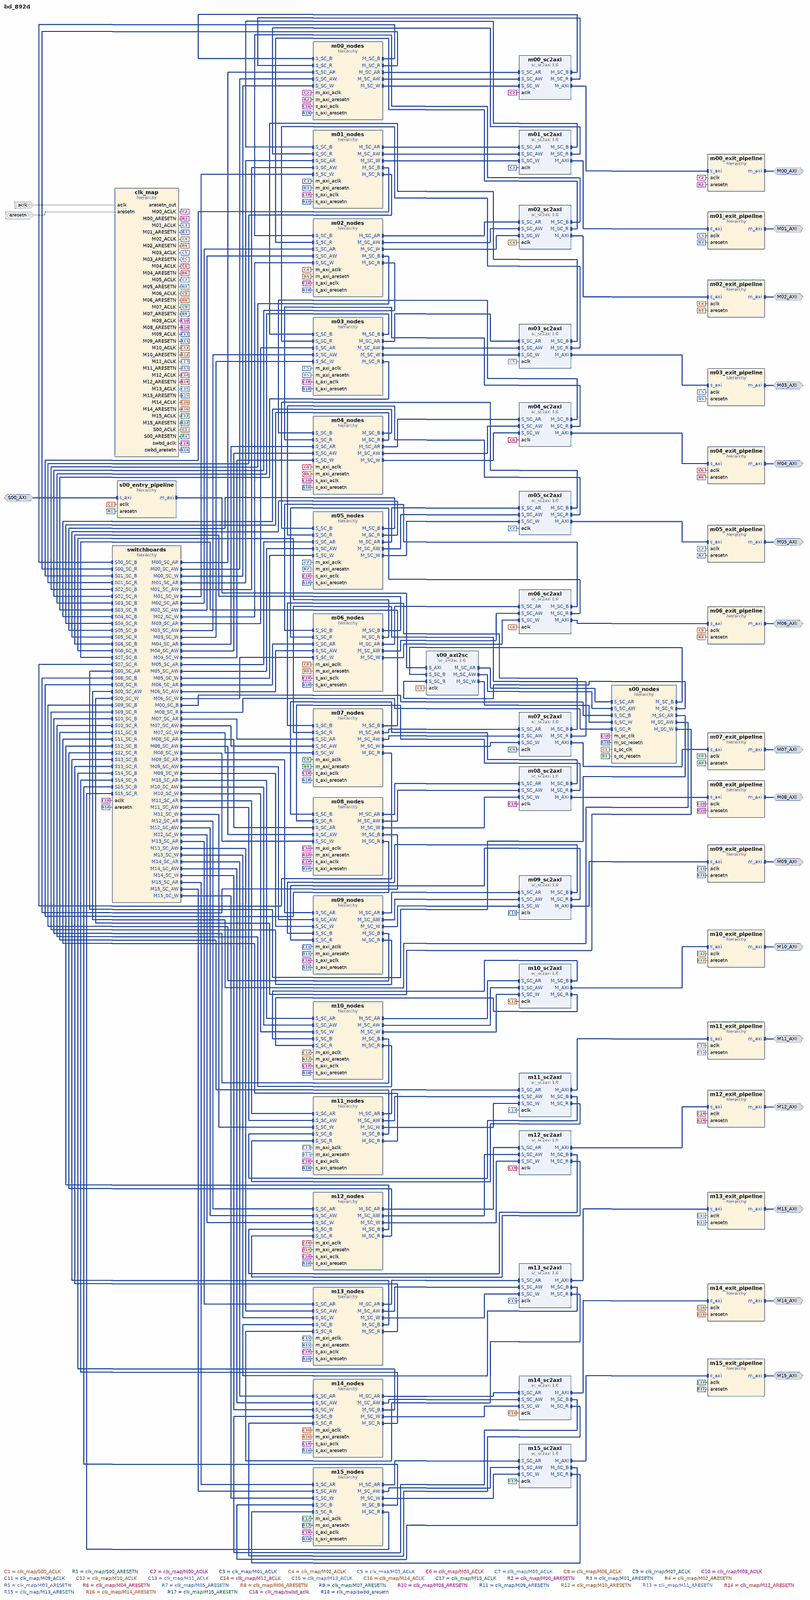
[diagram p0: block diagram of the top level, whole]
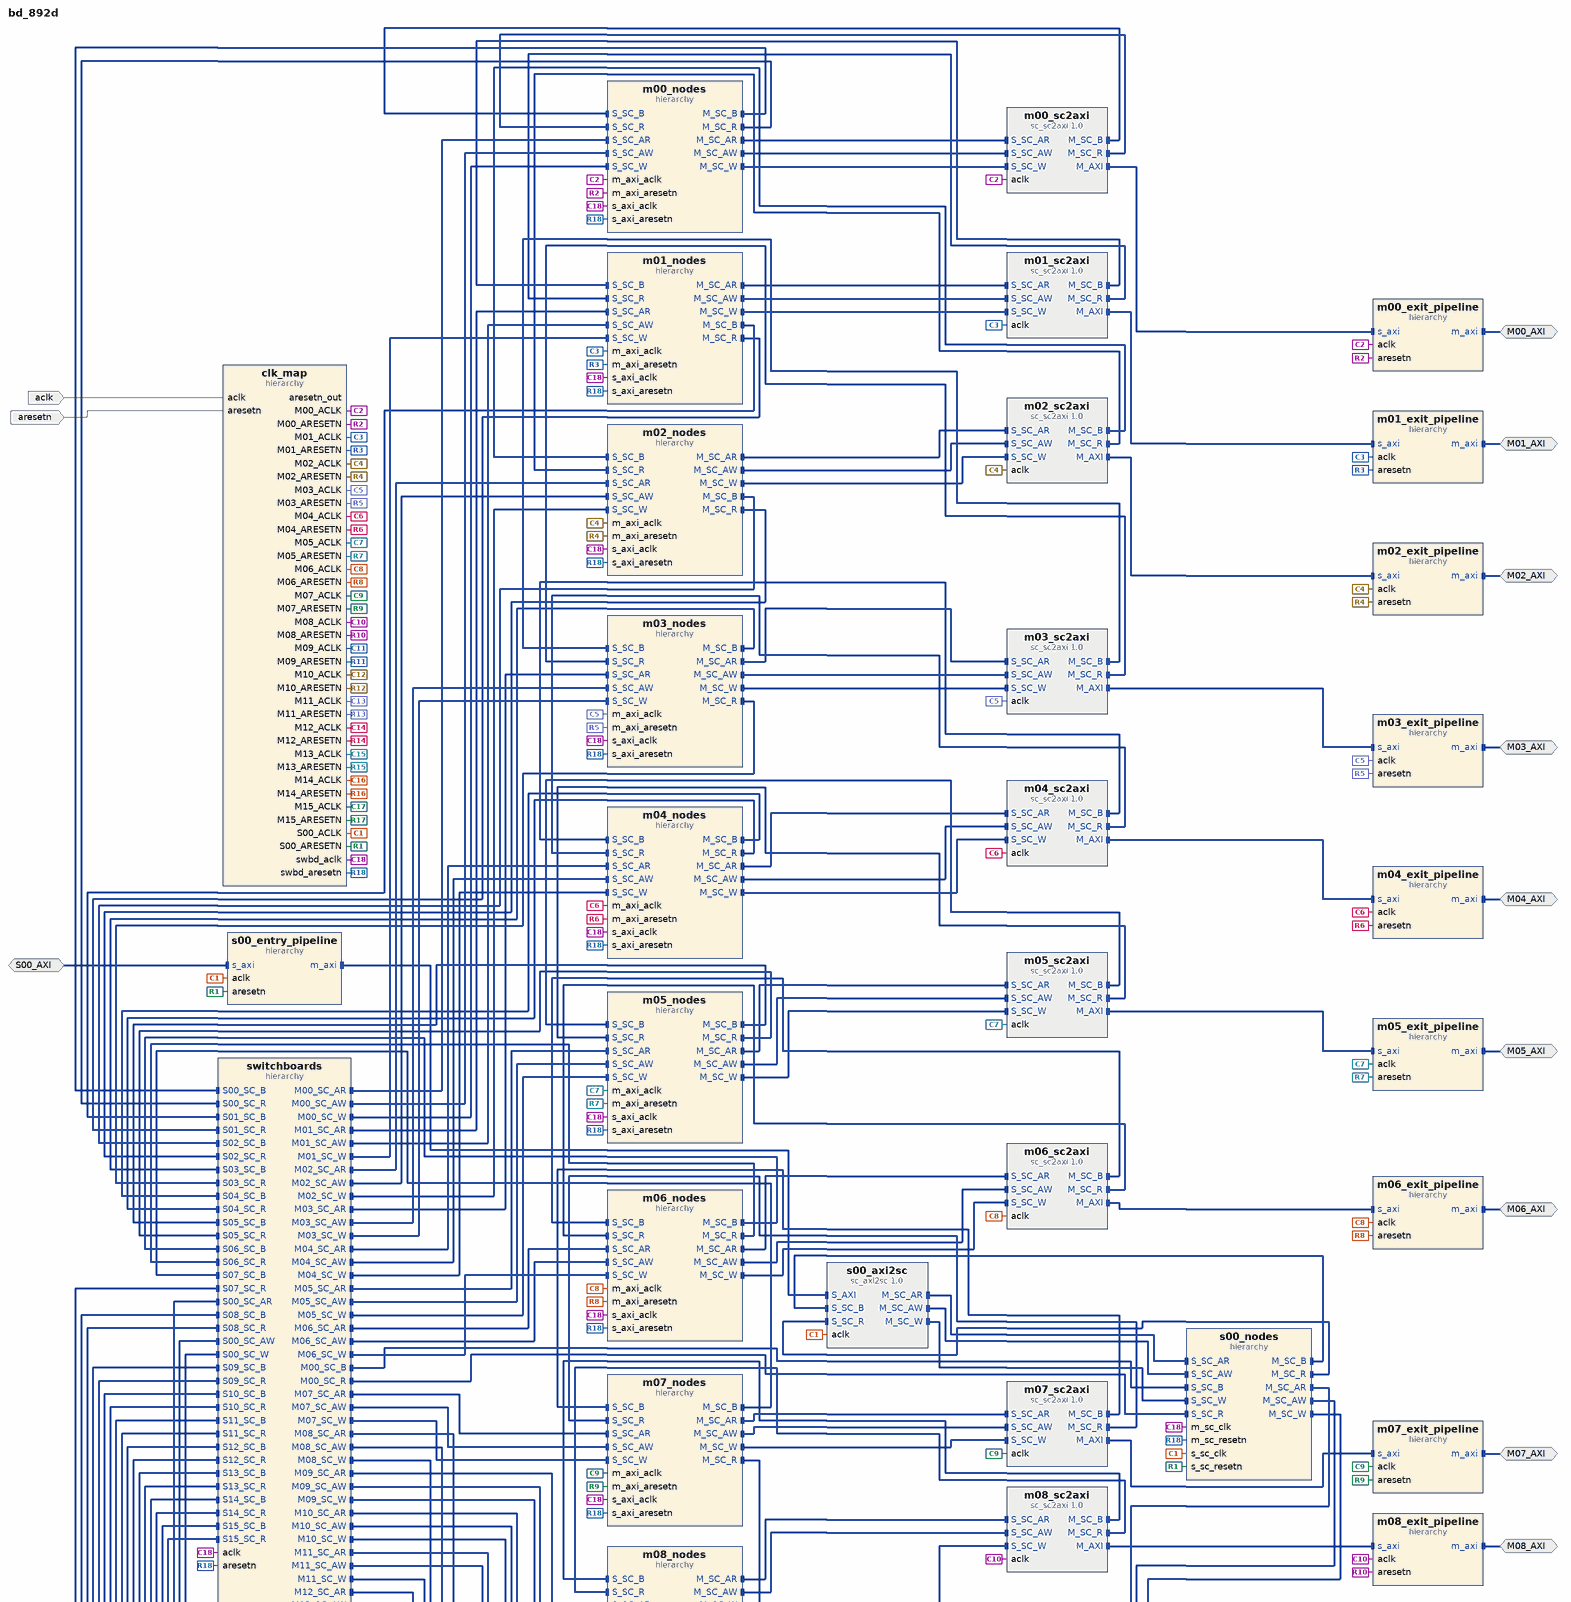
[diagram p1: block diagram of the top level, upper part]
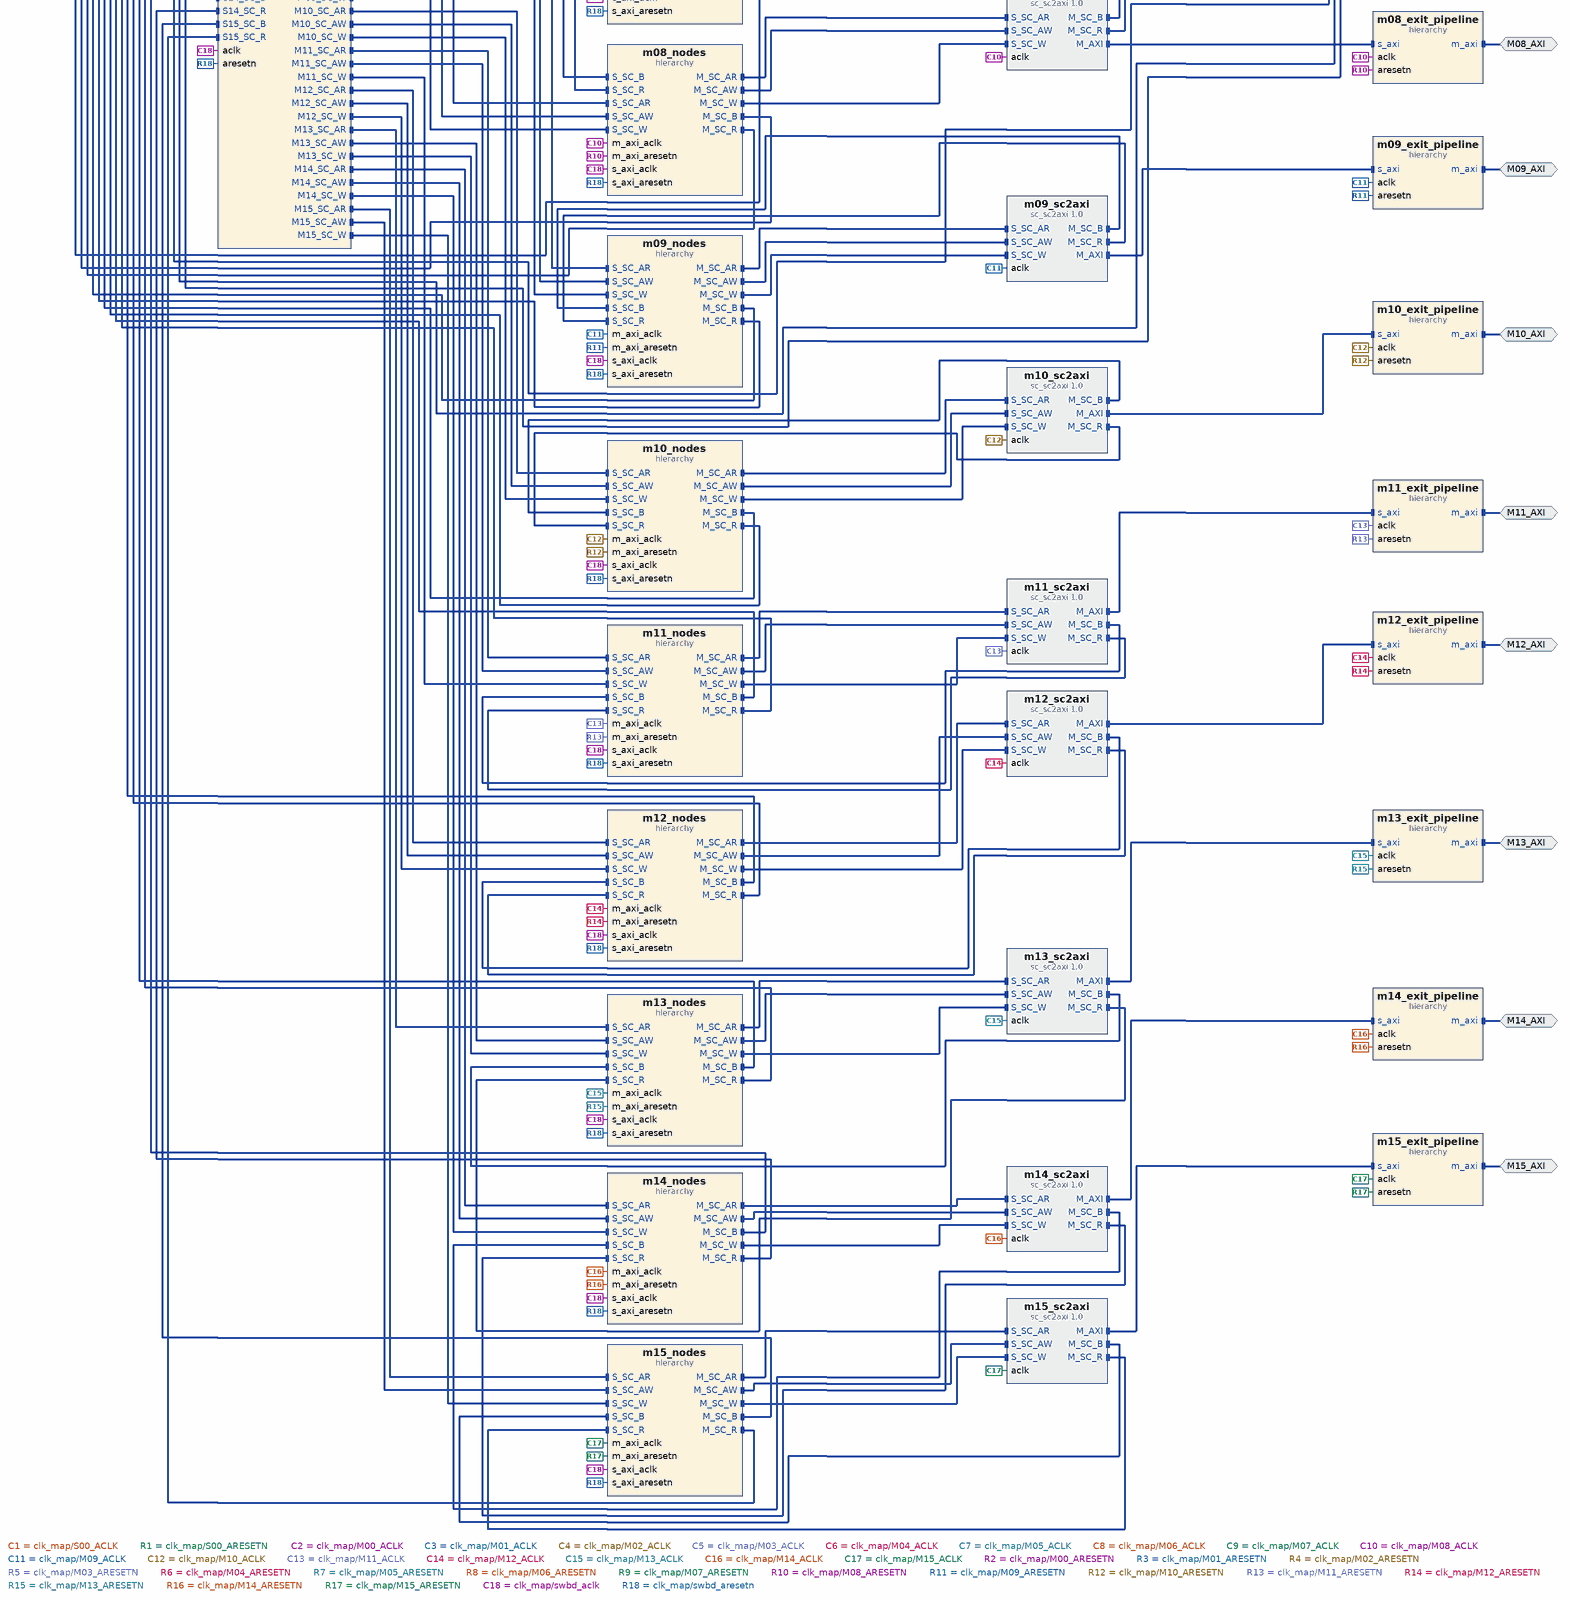
[diagram p2: block diagram of the top level, lower part]
# Vivado block design bd_892d, xczu48dr-ffvg1517-2-e, Vivado 2024.1
create_bd_design bd_892d

create_bd_intf_port -mode Slave -vlnv xilinx.com:interface:aximm_rtl:1.0 S00_AXI
set_property -dict {CONFIG.NUM_READ_OUTSTANDING 8 CONFIG.NUM_WRITE_OUTSTANDING 8} [get_bd_intf_ports S00_AXI]
create_bd_intf_port -mode Master -vlnv xilinx.com:interface:aximm_rtl:1.0 M00_AXI
set_property -dict [list \
  CONFIG.MAX_BURST_LENGTH 256 \
  CONFIG.NUM_READ_OUTSTANDING 8 \
  CONFIG.NUM_READ_THREADS 1 \
  CONFIG.NUM_WRITE_OUTSTANDING 8 \
  CONFIG.NUM_WRITE_THREADS 1 \
  CONFIG.RUSER_BITS_PER_BYTE 0 \
  CONFIG.SUPPORTS_NARROW_BURST 0 \
  CONFIG.WUSER_BITS_PER_BYTE 0 \
] [get_bd_intf_ports M00_AXI]
create_bd_intf_port -mode Master -vlnv xilinx.com:interface:aximm_rtl:1.0 M01_AXI
set_property -dict [list \
  CONFIG.MAX_BURST_LENGTH 256 \
  CONFIG.NUM_READ_OUTSTANDING 8 \
  CONFIG.NUM_READ_THREADS 1 \
  CONFIG.NUM_WRITE_OUTSTANDING 8 \
  CONFIG.NUM_WRITE_THREADS 1 \
  CONFIG.RUSER_BITS_PER_BYTE 0 \
  CONFIG.SUPPORTS_NARROW_BURST 0 \
  CONFIG.WUSER_BITS_PER_BYTE 0 \
] [get_bd_intf_ports M01_AXI]
create_bd_intf_port -mode Master -vlnv xilinx.com:interface:aximm_rtl:1.0 M02_AXI
set_property -dict [list \
  CONFIG.MAX_BURST_LENGTH 256 \
  CONFIG.NUM_READ_OUTSTANDING 8 \
  CONFIG.NUM_READ_THREADS 1 \
  CONFIG.NUM_WRITE_OUTSTANDING 8 \
  CONFIG.NUM_WRITE_THREADS 1 \
  CONFIG.RUSER_BITS_PER_BYTE 0 \
  CONFIG.SUPPORTS_NARROW_BURST 0 \
  CONFIG.WUSER_BITS_PER_BYTE 0 \
] [get_bd_intf_ports M02_AXI]
create_bd_intf_port -mode Master -vlnv xilinx.com:interface:aximm_rtl:1.0 M03_AXI
set_property -dict [list \
  CONFIG.MAX_BURST_LENGTH 256 \
  CONFIG.NUM_READ_OUTSTANDING 8 \
  CONFIG.NUM_READ_THREADS 1 \
  CONFIG.NUM_WRITE_OUTSTANDING 8 \
  CONFIG.NUM_WRITE_THREADS 1 \
  CONFIG.RUSER_BITS_PER_BYTE 0 \
  CONFIG.SUPPORTS_NARROW_BURST 0 \
  CONFIG.WUSER_BITS_PER_BYTE 0 \
] [get_bd_intf_ports M03_AXI]
create_bd_intf_port -mode Master -vlnv xilinx.com:interface:aximm_rtl:1.0 M04_AXI
set_property -dict [list \
  CONFIG.MAX_BURST_LENGTH 1 \
  CONFIG.NUM_READ_OUTSTANDING 8 \
  CONFIG.NUM_READ_THREADS 1 \
  CONFIG.NUM_WRITE_OUTSTANDING 8 \
  CONFIG.NUM_WRITE_THREADS 1 \
  CONFIG.RUSER_BITS_PER_BYTE 0 \
  CONFIG.SUPPORTS_NARROW_BURST 0 \
  CONFIG.WUSER_BITS_PER_BYTE 0 \
] [get_bd_intf_ports M04_AXI]
create_bd_intf_port -mode Master -vlnv xilinx.com:interface:aximm_rtl:1.0 M05_AXI
set_property -dict [list \
  CONFIG.MAX_BURST_LENGTH 1 \
  CONFIG.NUM_READ_OUTSTANDING 8 \
  CONFIG.NUM_READ_THREADS 1 \
  CONFIG.NUM_WRITE_OUTSTANDING 8 \
  CONFIG.NUM_WRITE_THREADS 1 \
  CONFIG.RUSER_BITS_PER_BYTE 0 \
  CONFIG.SUPPORTS_NARROW_BURST 0 \
  CONFIG.WUSER_BITS_PER_BYTE 0 \
] [get_bd_intf_ports M05_AXI]
create_bd_intf_port -mode Master -vlnv xilinx.com:interface:aximm_rtl:1.0 M06_AXI
set_property -dict [list \
  CONFIG.MAX_BURST_LENGTH 1 \
  CONFIG.NUM_READ_OUTSTANDING 8 \
  CONFIG.NUM_READ_THREADS 1 \
  CONFIG.NUM_WRITE_OUTSTANDING 8 \
  CONFIG.NUM_WRITE_THREADS 1 \
  CONFIG.RUSER_BITS_PER_BYTE 0 \
  CONFIG.SUPPORTS_NARROW_BURST 0 \
  CONFIG.WUSER_BITS_PER_BYTE 0 \
] [get_bd_intf_ports M06_AXI]
create_bd_intf_port -mode Master -vlnv xilinx.com:interface:aximm_rtl:1.0 M07_AXI
set_property -dict [list \
  CONFIG.MAX_BURST_LENGTH 1 \
  CONFIG.NUM_READ_OUTSTANDING 8 \
  CONFIG.NUM_READ_THREADS 1 \
  CONFIG.NUM_WRITE_OUTSTANDING 8 \
  CONFIG.NUM_WRITE_THREADS 1 \
  CONFIG.RUSER_BITS_PER_BYTE 0 \
  CONFIG.SUPPORTS_NARROW_BURST 0 \
  CONFIG.WUSER_BITS_PER_BYTE 0 \
] [get_bd_intf_ports M07_AXI]
create_bd_intf_port -mode Master -vlnv xilinx.com:interface:aximm_rtl:1.0 M08_AXI
set_property -dict [list \
  CONFIG.MAX_BURST_LENGTH 1 \
  CONFIG.NUM_READ_OUTSTANDING 8 \
  CONFIG.NUM_READ_THREADS 1 \
  CONFIG.NUM_WRITE_OUTSTANDING 8 \
  CONFIG.NUM_WRITE_THREADS 1 \
  CONFIG.RUSER_BITS_PER_BYTE 0 \
  CONFIG.SUPPORTS_NARROW_BURST 0 \
  CONFIG.WUSER_BITS_PER_BYTE 0 \
] [get_bd_intf_ports M08_AXI]
create_bd_intf_port -mode Master -vlnv xilinx.com:interface:aximm_rtl:1.0 M09_AXI
set_property -dict [list \
  CONFIG.MAX_BURST_LENGTH 1 \
  CONFIG.NUM_READ_OUTSTANDING 8 \
  CONFIG.NUM_READ_THREADS 1 \
  CONFIG.NUM_WRITE_OUTSTANDING 8 \
  CONFIG.NUM_WRITE_THREADS 1 \
  CONFIG.RUSER_BITS_PER_BYTE 0 \
  CONFIG.SUPPORTS_NARROW_BURST 0 \
  CONFIG.WUSER_BITS_PER_BYTE 0 \
] [get_bd_intf_ports M09_AXI]
create_bd_intf_port -mode Master -vlnv xilinx.com:interface:aximm_rtl:1.0 M10_AXI
set_property -dict [list \
  CONFIG.MAX_BURST_LENGTH 1 \
  CONFIG.NUM_READ_OUTSTANDING 8 \
  CONFIG.NUM_READ_THREADS 1 \
  CONFIG.NUM_WRITE_OUTSTANDING 8 \
  CONFIG.NUM_WRITE_THREADS 1 \
  CONFIG.RUSER_BITS_PER_BYTE 0 \
  CONFIG.SUPPORTS_NARROW_BURST 0 \
  CONFIG.WUSER_BITS_PER_BYTE 0 \
] [get_bd_intf_ports M10_AXI]
create_bd_intf_port -mode Master -vlnv xilinx.com:interface:aximm_rtl:1.0 M11_AXI
set_property -dict [list \
  CONFIG.MAX_BURST_LENGTH 1 \
  CONFIG.NUM_READ_OUTSTANDING 8 \
  CONFIG.NUM_READ_THREADS 1 \
  CONFIG.NUM_WRITE_OUTSTANDING 8 \
  CONFIG.NUM_WRITE_THREADS 1 \
  CONFIG.RUSER_BITS_PER_BYTE 0 \
  CONFIG.SUPPORTS_NARROW_BURST 0 \
  CONFIG.WUSER_BITS_PER_BYTE 0 \
] [get_bd_intf_ports M11_AXI]
create_bd_intf_port -mode Master -vlnv xilinx.com:interface:aximm_rtl:1.0 M12_AXI
set_property -dict [list \
  CONFIG.MAX_BURST_LENGTH 1 \
  CONFIG.NUM_READ_OUTSTANDING 8 \
  CONFIG.NUM_READ_THREADS 1 \
  CONFIG.NUM_WRITE_OUTSTANDING 8 \
  CONFIG.NUM_WRITE_THREADS 1 \
  CONFIG.RUSER_BITS_PER_BYTE 0 \
  CONFIG.SUPPORTS_NARROW_BURST 0 \
  CONFIG.WUSER_BITS_PER_BYTE 0 \
] [get_bd_intf_ports M12_AXI]
create_bd_intf_port -mode Master -vlnv xilinx.com:interface:aximm_rtl:1.0 M13_AXI
set_property -dict [list \
  CONFIG.MAX_BURST_LENGTH 1 \
  CONFIG.NUM_READ_OUTSTANDING 8 \
  CONFIG.NUM_READ_THREADS 1 \
  CONFIG.NUM_WRITE_OUTSTANDING 8 \
  CONFIG.NUM_WRITE_THREADS 1 \
  CONFIG.RUSER_BITS_PER_BYTE 0 \
  CONFIG.SUPPORTS_NARROW_BURST 0 \
  CONFIG.WUSER_BITS_PER_BYTE 0 \
] [get_bd_intf_ports M13_AXI]
create_bd_intf_port -mode Master -vlnv xilinx.com:interface:aximm_rtl:1.0 M14_AXI
set_property -dict [list \
  CONFIG.MAX_BURST_LENGTH 1 \
  CONFIG.NUM_READ_OUTSTANDING 8 \
  CONFIG.NUM_READ_THREADS 1 \
  CONFIG.NUM_WRITE_OUTSTANDING 8 \
  CONFIG.NUM_WRITE_THREADS 1 \
  CONFIG.RUSER_BITS_PER_BYTE 0 \
  CONFIG.SUPPORTS_NARROW_BURST 0 \
  CONFIG.WUSER_BITS_PER_BYTE 0 \
] [get_bd_intf_ports M14_AXI]
create_bd_intf_port -mode Master -vlnv xilinx.com:interface:aximm_rtl:1.0 M15_AXI
set_property -dict [list \
  CONFIG.MAX_BURST_LENGTH 1 \
  CONFIG.NUM_READ_OUTSTANDING 8 \
  CONFIG.NUM_READ_THREADS 1 \
  CONFIG.NUM_WRITE_OUTSTANDING 8 \
  CONFIG.NUM_WRITE_THREADS 1 \
  CONFIG.RUSER_BITS_PER_BYTE 0 \
  CONFIG.SUPPORTS_NARROW_BURST 0 \
  CONFIG.WUSER_BITS_PER_BYTE 0 \
] [get_bd_intf_ports M15_AXI]
create_bd_port -dir I -type clk aclk
set_property -dict [list \
  CONFIG.ASSOCIATED_BUSIF M00_AXI:M01_AXI:M02_AXI:M03_AXI:M04_AXI:M05_AXI:M06_AXI:M07_AXI:M08_AXI:M09_AXI:M10_AXI:M11_AXI:M12_AXI:M13_AXI:M14_AXI:M15_AXI:S00_AXI \
] [get_bd_ports aclk]
create_bd_port -dir I -type rst aresetn
set_property -dict {CONFIG.POLARITY ACTIVE_LOW} [get_bd_ports aresetn]

create_bd_cell -type hier clk_map
create_bd_cell -type hier switchboards
create_bd_cell -type hier s00_entry_pipeline
create_bd_cell -type ip -vlnv xilinx.com:ip:sc_axi2sc:1.0 s00_axi2sc
set_property -dict [list \
  CONFIG.AXI_ADDR_WIDTH 40 \
  CONFIG.AXI_ID_WIDTH 4 \
  CONFIG.AXI_RDATA_WIDTH 32 \
  CONFIG.AXI_WDATA_WIDTH 32 \
  CONFIG.MSC_ROUTE_WIDTH 16 \
  CONFIG.READ_WRITE_MODE READ_WRITE \
  CONFIG.SC_ADDR_WIDTH 40 \
  CONFIG.SC_ARUSER_WIDTH 130 \
  CONFIG.SC_AWUSER_WIDTH 130 \
  CONFIG.SC_BUSER_WIDTH 114 \
  CONFIG.SC_ID_WIDTH 4 \
  CONFIG.SC_RDATA_WIDTH 32 \
  CONFIG.SC_RUSER_BITS_PER_BYTE 0 \
  CONFIG.SC_WDATA_WIDTH 32 \
  CONFIG.SC_WUSER_BITS_PER_BYTE 0 \
  CONFIG.SSC_ROUTE_WIDTH 1 \
] [get_bd_cells s00_axi2sc]
create_bd_cell -type hier s00_nodes
create_bd_cell -type ip -vlnv xilinx.com:ip:sc_sc2axi:1.0 m00_sc2axi
set_property -dict [list \
  CONFIG.AXI_ADDR_WIDTH 13 \
  CONFIG.AXI_ID_WIDTH 4 \
  CONFIG.AXI_RDATA_WIDTH 32 \
  CONFIG.AXI_WDATA_WIDTH 32 \
  CONFIG.MSC_ROUTE_WIDTH 16 \
  CONFIG.READ_WRITE_MODE READ_WRITE \
  CONFIG.SC_ADDR_WIDTH 40 \
  CONFIG.SC_ARUSER_WIDTH 130 \
  CONFIG.SC_AWUSER_WIDTH 130 \
  CONFIG.SC_BUSER_WIDTH 114 \
  CONFIG.SC_ID_WIDTH 4 \
  CONFIG.SC_RDATA_WIDTH 32 \
  CONFIG.SC_RUSER_BITS_PER_BYTE 0 \
  CONFIG.SC_WDATA_WIDTH 32 \
  CONFIG.SC_WUSER_BITS_PER_BYTE 0 \
  CONFIG.SSC_ROUTE_WIDTH 1 \
] [get_bd_cells m00_sc2axi]
create_bd_cell -type hier m00_nodes
create_bd_cell -type hier m00_exit_pipeline
create_bd_cell -type ip -vlnv xilinx.com:ip:sc_sc2axi:1.0 m01_sc2axi
set_property -dict [list \
  CONFIG.AXI_ADDR_WIDTH 13 \
  CONFIG.AXI_ID_WIDTH 4 \
  CONFIG.AXI_RDATA_WIDTH 32 \
  CONFIG.AXI_WDATA_WIDTH 32 \
  CONFIG.MSC_ROUTE_WIDTH 16 \
  CONFIG.READ_WRITE_MODE READ_WRITE \
  CONFIG.SC_ADDR_WIDTH 40 \
  CONFIG.SC_ARUSER_WIDTH 130 \
  CONFIG.SC_AWUSER_WIDTH 130 \
  CONFIG.SC_BUSER_WIDTH 114 \
  CONFIG.SC_ID_WIDTH 4 \
  CONFIG.SC_RDATA_WIDTH 32 \
  CONFIG.SC_RUSER_BITS_PER_BYTE 0 \
  CONFIG.SC_WDATA_WIDTH 32 \
  CONFIG.SC_WUSER_BITS_PER_BYTE 0 \
  CONFIG.SSC_ROUTE_WIDTH 1 \
] [get_bd_cells m01_sc2axi]
create_bd_cell -type hier m01_nodes
create_bd_cell -type hier m01_exit_pipeline
create_bd_cell -type ip -vlnv xilinx.com:ip:sc_sc2axi:1.0 m02_sc2axi
set_property -dict [list \
  CONFIG.AXI_ADDR_WIDTH 13 \
  CONFIG.AXI_ID_WIDTH 4 \
  CONFIG.AXI_RDATA_WIDTH 32 \
  CONFIG.AXI_WDATA_WIDTH 32 \
  CONFIG.MSC_ROUTE_WIDTH 16 \
  CONFIG.READ_WRITE_MODE READ_WRITE \
  CONFIG.SC_ADDR_WIDTH 40 \
  CONFIG.SC_ARUSER_WIDTH 130 \
  CONFIG.SC_AWUSER_WIDTH 130 \
  CONFIG.SC_BUSER_WIDTH 114 \
  CONFIG.SC_ID_WIDTH 4 \
  CONFIG.SC_RDATA_WIDTH 32 \
  CONFIG.SC_RUSER_BITS_PER_BYTE 0 \
  CONFIG.SC_WDATA_WIDTH 32 \
  CONFIG.SC_WUSER_BITS_PER_BYTE 0 \
  CONFIG.SSC_ROUTE_WIDTH 1 \
] [get_bd_cells m02_sc2axi]
create_bd_cell -type hier m02_nodes
create_bd_cell -type hier m02_exit_pipeline
create_bd_cell -type ip -vlnv xilinx.com:ip:sc_sc2axi:1.0 m03_sc2axi
set_property -dict [list \
  CONFIG.AXI_ADDR_WIDTH 13 \
  CONFIG.AXI_ID_WIDTH 4 \
  CONFIG.AXI_RDATA_WIDTH 32 \
  CONFIG.AXI_WDATA_WIDTH 32 \
  CONFIG.MSC_ROUTE_WIDTH 16 \
  CONFIG.READ_WRITE_MODE READ_WRITE \
  CONFIG.SC_ADDR_WIDTH 40 \
  CONFIG.SC_ARUSER_WIDTH 130 \
  CONFIG.SC_AWUSER_WIDTH 130 \
  CONFIG.SC_BUSER_WIDTH 114 \
  CONFIG.SC_ID_WIDTH 4 \
  CONFIG.SC_RDATA_WIDTH 32 \
  CONFIG.SC_RUSER_BITS_PER_BYTE 0 \
  CONFIG.SC_WDATA_WIDTH 32 \
  CONFIG.SC_WUSER_BITS_PER_BYTE 0 \
  CONFIG.SSC_ROUTE_WIDTH 1 \
] [get_bd_cells m03_sc2axi]
create_bd_cell -type hier m03_nodes
create_bd_cell -type hier m03_exit_pipeline
create_bd_cell -type ip -vlnv xilinx.com:ip:sc_sc2axi:1.0 m04_sc2axi
set_property -dict [list \
  CONFIG.AXI_ADDR_WIDTH 10 \
  CONFIG.AXI_ID_WIDTH 4 \
  CONFIG.AXI_RDATA_WIDTH 32 \
  CONFIG.AXI_WDATA_WIDTH 32 \
  CONFIG.MSC_ROUTE_WIDTH 16 \
  CONFIG.READ_WRITE_MODE READ_WRITE \
  CONFIG.SC_ADDR_WIDTH 40 \
  CONFIG.SC_ARUSER_WIDTH 130 \
  CONFIG.SC_AWUSER_WIDTH 130 \
  CONFIG.SC_BUSER_WIDTH 114 \
  CONFIG.SC_ID_WIDTH 4 \
  CONFIG.SC_RDATA_WIDTH 32 \
  CONFIG.SC_RUSER_BITS_PER_BYTE 0 \
  CONFIG.SC_WDATA_WIDTH 32 \
  CONFIG.SC_WUSER_BITS_PER_BYTE 0 \
  CONFIG.SSC_ROUTE_WIDTH 1 \
] [get_bd_cells m04_sc2axi]
create_bd_cell -type hier m04_nodes
create_bd_cell -type hier m04_exit_pipeline
create_bd_cell -type ip -vlnv xilinx.com:ip:sc_sc2axi:1.0 m05_sc2axi
set_property -dict [list \
  CONFIG.AXI_ADDR_WIDTH 10 \
  CONFIG.AXI_ID_WIDTH 4 \
  CONFIG.AXI_RDATA_WIDTH 32 \
  CONFIG.AXI_WDATA_WIDTH 32 \
  CONFIG.MSC_ROUTE_WIDTH 16 \
  CONFIG.READ_WRITE_MODE READ_WRITE \
  CONFIG.SC_ADDR_WIDTH 40 \
  CONFIG.SC_ARUSER_WIDTH 130 \
  CONFIG.SC_AWUSER_WIDTH 130 \
  CONFIG.SC_BUSER_WIDTH 114 \
  CONFIG.SC_ID_WIDTH 4 \
  CONFIG.SC_RDATA_WIDTH 32 \
  CONFIG.SC_RUSER_BITS_PER_BYTE 0 \
  CONFIG.SC_WDATA_WIDTH 32 \
  CONFIG.SC_WUSER_BITS_PER_BYTE 0 \
  CONFIG.SSC_ROUTE_WIDTH 1 \
] [get_bd_cells m05_sc2axi]
create_bd_cell -type hier m05_nodes
create_bd_cell -type hier m05_exit_pipeline
create_bd_cell -type ip -vlnv xilinx.com:ip:sc_sc2axi:1.0 m06_sc2axi
set_property -dict [list \
  CONFIG.AXI_ADDR_WIDTH 10 \
  CONFIG.AXI_ID_WIDTH 4 \
  CONFIG.AXI_RDATA_WIDTH 32 \
  CONFIG.AXI_WDATA_WIDTH 32 \
  CONFIG.MSC_ROUTE_WIDTH 16 \
  CONFIG.READ_WRITE_MODE READ_WRITE \
  CONFIG.SC_ADDR_WIDTH 40 \
  CONFIG.SC_ARUSER_WIDTH 130 \
  CONFIG.SC_AWUSER_WIDTH 130 \
  CONFIG.SC_BUSER_WIDTH 114 \
  CONFIG.SC_ID_WIDTH 4 \
  CONFIG.SC_RDATA_WIDTH 32 \
  CONFIG.SC_RUSER_BITS_PER_BYTE 0 \
  CONFIG.SC_WDATA_WIDTH 32 \
  CONFIG.SC_WUSER_BITS_PER_BYTE 0 \
  CONFIG.SSC_ROUTE_WIDTH 1 \
] [get_bd_cells m06_sc2axi]
create_bd_cell -type hier m06_nodes
create_bd_cell -type hier m06_exit_pipeline
create_bd_cell -type ip -vlnv xilinx.com:ip:sc_sc2axi:1.0 m07_sc2axi
set_property -dict [list \
  CONFIG.AXI_ADDR_WIDTH 10 \
  CONFIG.AXI_ID_WIDTH 4 \
  CONFIG.AXI_RDATA_WIDTH 32 \
  CONFIG.AXI_WDATA_WIDTH 32 \
  CONFIG.MSC_ROUTE_WIDTH 16 \
  CONFIG.READ_WRITE_MODE READ_WRITE \
  CONFIG.SC_ADDR_WIDTH 40 \
  CONFIG.SC_ARUSER_WIDTH 130 \
  CONFIG.SC_AWUSER_WIDTH 130 \
  CONFIG.SC_BUSER_WIDTH 114 \
  CONFIG.SC_ID_WIDTH 4 \
  CONFIG.SC_RDATA_WIDTH 32 \
  CONFIG.SC_RUSER_BITS_PER_BYTE 0 \
  CONFIG.SC_WDATA_WIDTH 32 \
  CONFIG.SC_WUSER_BITS_PER_BYTE 0 \
  CONFIG.SSC_ROUTE_WIDTH 1 \
] [get_bd_cells m07_sc2axi]
create_bd_cell -type hier m07_nodes
create_bd_cell -type hier m07_exit_pipeline
create_bd_cell -type ip -vlnv xilinx.com:ip:sc_sc2axi:1.0 m08_sc2axi
set_property -dict [list \
  CONFIG.AXI_ADDR_WIDTH 10 \
  CONFIG.AXI_ID_WIDTH 4 \
  CONFIG.AXI_RDATA_WIDTH 32 \
  CONFIG.AXI_WDATA_WIDTH 32 \
  CONFIG.MSC_ROUTE_WIDTH 16 \
  CONFIG.READ_WRITE_MODE READ_WRITE \
  CONFIG.SC_ADDR_WIDTH 40 \
  CONFIG.SC_ARUSER_WIDTH 130 \
  CONFIG.SC_AWUSER_WIDTH 130 \
  CONFIG.SC_BUSER_WIDTH 114 \
  CONFIG.SC_ID_WIDTH 4 \
  CONFIG.SC_RDATA_WIDTH 32 \
  CONFIG.SC_RUSER_BITS_PER_BYTE 0 \
  CONFIG.SC_WDATA_WIDTH 32 \
  CONFIG.SC_WUSER_BITS_PER_BYTE 0 \
  CONFIG.SSC_ROUTE_WIDTH 1 \
] [get_bd_cells m08_sc2axi]
create_bd_cell -type hier m08_nodes
create_bd_cell -type hier m08_exit_pipeline
create_bd_cell -type ip -vlnv xilinx.com:ip:sc_sc2axi:1.0 m09_sc2axi
set_property -dict [list \
  CONFIG.AXI_ADDR_WIDTH 10 \
  CONFIG.AXI_ID_WIDTH 4 \
  CONFIG.AXI_RDATA_WIDTH 32 \
  CONFIG.AXI_WDATA_WIDTH 32 \
  CONFIG.MSC_ROUTE_WIDTH 16 \
  CONFIG.READ_WRITE_MODE READ_WRITE \
  CONFIG.SC_ADDR_WIDTH 40 \
  CONFIG.SC_ARUSER_WIDTH 130 \
  CONFIG.SC_AWUSER_WIDTH 130 \
  CONFIG.SC_BUSER_WIDTH 114 \
  CONFIG.SC_ID_WIDTH 4 \
  CONFIG.SC_RDATA_WIDTH 32 \
  CONFIG.SC_RUSER_BITS_PER_BYTE 0 \
  CONFIG.SC_WDATA_WIDTH 32 \
  CONFIG.SC_WUSER_BITS_PER_BYTE 0 \
  CONFIG.SSC_ROUTE_WIDTH 1 \
] [get_bd_cells m09_sc2axi]
create_bd_cell -type hier m09_nodes
create_bd_cell -type hier m09_exit_pipeline
create_bd_cell -type ip -vlnv xilinx.com:ip:sc_sc2axi:1.0 m10_sc2axi
set_property -dict [list \
  CONFIG.AXI_ADDR_WIDTH 10 \
  CONFIG.AXI_ID_WIDTH 4 \
  CONFIG.AXI_RDATA_WIDTH 32 \
  CONFIG.AXI_WDATA_WIDTH 32 \
  CONFIG.MSC_ROUTE_WIDTH 16 \
  CONFIG.READ_WRITE_MODE READ_WRITE \
  CONFIG.SC_ADDR_WIDTH 40 \
  CONFIG.SC_ARUSER_WIDTH 130 \
  CONFIG.SC_AWUSER_WIDTH 130 \
  CONFIG.SC_BUSER_WIDTH 114 \
  CONFIG.SC_ID_WIDTH 4 \
  CONFIG.SC_RDATA_WIDTH 32 \
  CONFIG.SC_RUSER_BITS_PER_BYTE 0 \
  CONFIG.SC_WDATA_WIDTH 32 \
  CONFIG.SC_WUSER_BITS_PER_BYTE 0 \
  CONFIG.SSC_ROUTE_WIDTH 1 \
] [get_bd_cells m10_sc2axi]
create_bd_cell -type hier m10_nodes
create_bd_cell -type hier m10_exit_pipeline
create_bd_cell -type ip -vlnv xilinx.com:ip:sc_sc2axi:1.0 m11_sc2axi
set_property -dict [list \
  CONFIG.AXI_ADDR_WIDTH 10 \
  CONFIG.AXI_ID_WIDTH 4 \
  CONFIG.AXI_RDATA_WIDTH 32 \
  CONFIG.AXI_WDATA_WIDTH 32 \
  CONFIG.MSC_ROUTE_WIDTH 16 \
  CONFIG.READ_WRITE_MODE READ_WRITE \
  CONFIG.SC_ADDR_WIDTH 40 \
  CONFIG.SC_ARUSER_WIDTH 130 \
  CONFIG.SC_AWUSER_WIDTH 130 \
  CONFIG.SC_BUSER_WIDTH 114 \
  CONFIG.SC_ID_WIDTH 4 \
  CONFIG.SC_RDATA_WIDTH 32 \
  CONFIG.SC_RUSER_BITS_PER_BYTE 0 \
  CONFIG.SC_WDATA_WIDTH 32 \
  CONFIG.SC_WUSER_BITS_PER_BYTE 0 \
  CONFIG.SSC_ROUTE_WIDTH 1 \
] [get_bd_cells m11_sc2axi]
create_bd_cell -type hier m11_nodes
create_bd_cell -type hier m11_exit_pipeline
create_bd_cell -type ip -vlnv xilinx.com:ip:sc_sc2axi:1.0 m12_sc2axi
set_property -dict [list \
  CONFIG.AXI_ADDR_WIDTH 5 \
  CONFIG.AXI_ID_WIDTH 4 \
  CONFIG.AXI_RDATA_WIDTH 32 \
  CONFIG.AXI_WDATA_WIDTH 32 \
  CONFIG.MSC_ROUTE_WIDTH 16 \
  CONFIG.READ_WRITE_MODE READ_WRITE \
  CONFIG.SC_ADDR_WIDTH 40 \
  CONFIG.SC_ARUSER_WIDTH 130 \
  CONFIG.SC_AWUSER_WIDTH 130 \
  CONFIG.SC_BUSER_WIDTH 114 \
  CONFIG.SC_ID_WIDTH 4 \
  CONFIG.SC_RDATA_WIDTH 32 \
  CONFIG.SC_RUSER_BITS_PER_BYTE 0 \
  CONFIG.SC_WDATA_WIDTH 32 \
  CONFIG.SC_WUSER_BITS_PER_BYTE 0 \
  CONFIG.SSC_ROUTE_WIDTH 1 \
] [get_bd_cells m12_sc2axi]
create_bd_cell -type hier m12_nodes
create_bd_cell -type hier m12_exit_pipeline
create_bd_cell -type ip -vlnv xilinx.com:ip:sc_sc2axi:1.0 m13_sc2axi
set_property -dict [list \
  CONFIG.AXI_ADDR_WIDTH 5 \
  CONFIG.AXI_ID_WIDTH 4 \
  CONFIG.AXI_RDATA_WIDTH 32 \
  CONFIG.AXI_WDATA_WIDTH 32 \
  CONFIG.MSC_ROUTE_WIDTH 16 \
  CONFIG.READ_WRITE_MODE READ_WRITE \
  CONFIG.SC_ADDR_WIDTH 40 \
  CONFIG.SC_ARUSER_WIDTH 130 \
  CONFIG.SC_AWUSER_WIDTH 130 \
  CONFIG.SC_BUSER_WIDTH 114 \
  CONFIG.SC_ID_WIDTH 4 \
  CONFIG.SC_RDATA_WIDTH 32 \
  CONFIG.SC_RUSER_BITS_PER_BYTE 0 \
  CONFIG.SC_WDATA_WIDTH 32 \
  CONFIG.SC_WUSER_BITS_PER_BYTE 0 \
  CONFIG.SSC_ROUTE_WIDTH 1 \
] [get_bd_cells m13_sc2axi]
create_bd_cell -type hier m13_nodes
create_bd_cell -type hier m13_exit_pipeline
create_bd_cell -type ip -vlnv xilinx.com:ip:sc_sc2axi:1.0 m14_sc2axi
set_property -dict [list \
  CONFIG.AXI_ADDR_WIDTH 5 \
  CONFIG.AXI_ID_WIDTH 4 \
  CONFIG.AXI_RDATA_WIDTH 32 \
  CONFIG.AXI_WDATA_WIDTH 32 \
  CONFIG.MSC_ROUTE_WIDTH 16 \
  CONFIG.READ_WRITE_MODE READ_WRITE \
  CONFIG.SC_ADDR_WIDTH 40 \
  CONFIG.SC_ARUSER_WIDTH 130 \
  CONFIG.SC_AWUSER_WIDTH 130 \
  CONFIG.SC_BUSER_WIDTH 114 \
  CONFIG.SC_ID_WIDTH 4 \
  CONFIG.SC_RDATA_WIDTH 32 \
  CONFIG.SC_RUSER_BITS_PER_BYTE 0 \
  CONFIG.SC_WDATA_WIDTH 32 \
  CONFIG.SC_WUSER_BITS_PER_BYTE 0 \
  CONFIG.SSC_ROUTE_WIDTH 1 \
] [get_bd_cells m14_sc2axi]
create_bd_cell -type hier m14_nodes
create_bd_cell -type hier m14_exit_pipeline
create_bd_cell -type ip -vlnv xilinx.com:ip:sc_sc2axi:1.0 m15_sc2axi
set_property -dict [list \
  CONFIG.AXI_ADDR_WIDTH 5 \
  CONFIG.AXI_ID_WIDTH 4 \
  CONFIG.AXI_RDATA_WIDTH 32 \
  CONFIG.AXI_WDATA_WIDTH 32 \
  CONFIG.MSC_ROUTE_WIDTH 16 \
  CONFIG.READ_WRITE_MODE READ_WRITE \
  CONFIG.SC_ADDR_WIDTH 40 \
  CONFIG.SC_ARUSER_WIDTH 130 \
  CONFIG.SC_AWUSER_WIDTH 130 \
  CONFIG.SC_BUSER_WIDTH 114 \
  CONFIG.SC_ID_WIDTH 4 \
  CONFIG.SC_RDATA_WIDTH 32 \
  CONFIG.SC_RUSER_BITS_PER_BYTE 0 \
  CONFIG.SC_WDATA_WIDTH 32 \
  CONFIG.SC_WUSER_BITS_PER_BYTE 0 \
  CONFIG.SSC_ROUTE_WIDTH 1 \
] [get_bd_cells m15_sc2axi]
create_bd_cell -type hier m15_nodes
create_bd_cell -type hier m15_exit_pipeline

# ---- hierarchy /clk_map ----
current_bd_instance /clk_map
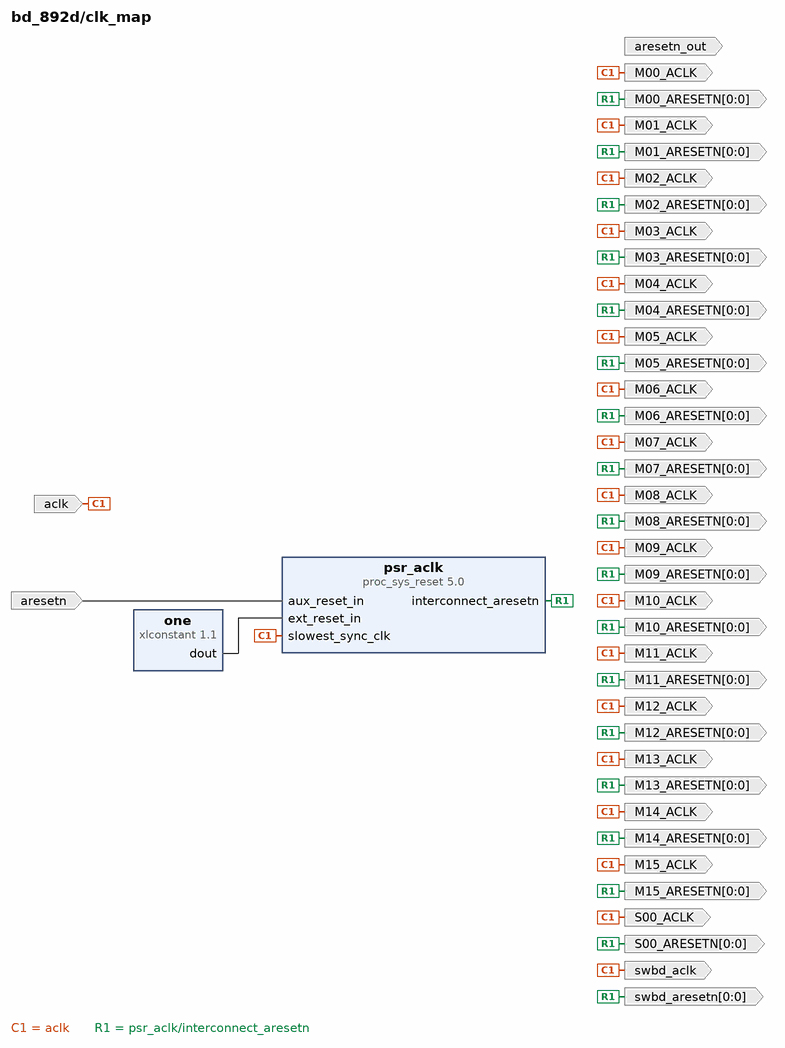
[diagram p3: block diagram inside /clk_map]
create_bd_pin -dir O -type clk S00_ACLK
create_bd_pin -dir O -from 0 -to 0 -type rst S00_ARESETN
create_bd_pin -dir O -type clk M00_ACLK
create_bd_pin -dir O -from 0 -to 0 -type rst M00_ARESETN
create_bd_pin -dir O -type clk M01_ACLK
create_bd_pin -dir O -from 0 -to 0 -type rst M01_ARESETN
create_bd_pin -dir O -type clk M02_ACLK
create_bd_pin -dir O -from 0 -to 0 -type rst M02_ARESETN
create_bd_pin -dir O -type clk M03_ACLK
create_bd_pin -dir O -from 0 -to 0 -type rst M03_ARESETN
create_bd_pin -dir O -type clk M04_ACLK
create_bd_pin -dir O -from 0 -to 0 -type rst M04_ARESETN
create_bd_pin -dir O -type clk M05_ACLK
create_bd_pin -dir O -from 0 -to 0 -type rst M05_ARESETN
create_bd_pin -dir O -type clk M06_ACLK
create_bd_pin -dir O -from 0 -to 0 -type rst M06_ARESETN
create_bd_pin -dir O -type clk M07_ACLK
create_bd_pin -dir O -from 0 -to 0 -type rst M07_ARESETN
create_bd_pin -dir O -type clk M08_ACLK
create_bd_pin -dir O -from 0 -to 0 -type rst M08_ARESETN
create_bd_pin -dir O -type clk M09_ACLK
create_bd_pin -dir O -from 0 -to 0 -type rst M09_ARESETN
create_bd_pin -dir O -type clk M10_ACLK
create_bd_pin -dir O -from 0 -to 0 -type rst M10_ARESETN
create_bd_pin -dir O -type clk M11_ACLK
create_bd_pin -dir O -from 0 -to 0 -type rst M11_ARESETN
create_bd_pin -dir O -type clk M12_ACLK
create_bd_pin -dir O -from 0 -to 0 -type rst M12_ARESETN
create_bd_pin -dir O -type clk M13_ACLK
create_bd_pin -dir O -from 0 -to 0 -type rst M13_ARESETN
create_bd_pin -dir O -type clk M14_ACLK
create_bd_pin -dir O -from 0 -to 0 -type rst M14_ARESETN
create_bd_pin -dir O -type clk M15_ACLK
create_bd_pin -dir O -from 0 -to 0 -type rst M15_ARESETN
create_bd_pin -dir O -type clk swbd_aclk
create_bd_pin -dir O -from 0 -to 0 -type rst swbd_aresetn
create_bd_pin -dir I -type rst aresetn
create_bd_pin -dir O -type rst aresetn_out
create_bd_pin -dir I -type clk aclk

create_bd_cell -type ip -vlnv xilinx.com:ip:xlconstant:1.1 one
create_bd_cell -type ip -vlnv xilinx.com:ip:proc_sys_reset:5.0 psr_aclk
set_property -dict {CONFIG.C_AUX_RESET_HIGH 0 CONFIG.C_AUX_RST_WIDTH 1} [get_bd_cells psr_aclk]

# ---- hierarchy /switchboards ----
current_bd_instance /switchboards
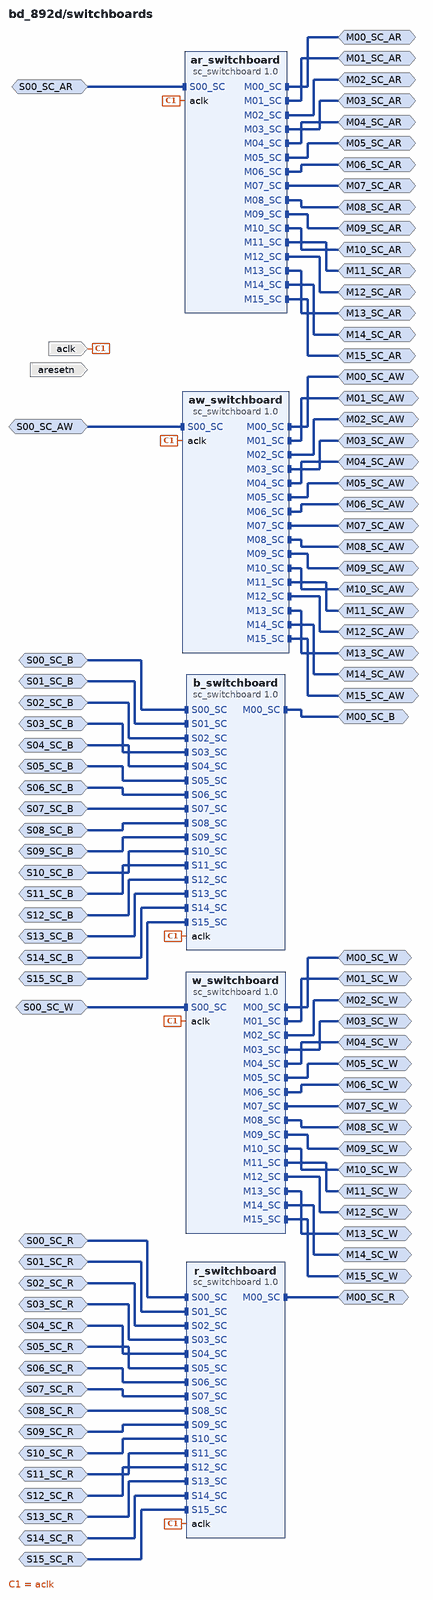
[diagram p4: block diagram inside /switchboards]
create_bd_intf_pin -mode Slave -vlnv xilinx.com:interface:sc_rtl:1.0 S00_SC_AR
create_bd_intf_pin -mode Master -vlnv xilinx.com:interface:sc_rtl:1.0 M00_SC_AR
create_bd_intf_pin -mode Master -vlnv xilinx.com:interface:sc_rtl:1.0 M01_SC_AR
create_bd_intf_pin -mode Master -vlnv xilinx.com:interface:sc_rtl:1.0 M02_SC_AR
create_bd_intf_pin -mode Master -vlnv xilinx.com:interface:sc_rtl:1.0 M03_SC_AR
create_bd_intf_pin -mode Master -vlnv xilinx.com:interface:sc_rtl:1.0 M04_SC_AR
create_bd_intf_pin -mode Master -vlnv xilinx.com:interface:sc_rtl:1.0 M05_SC_AR
create_bd_intf_pin -mode Master -vlnv xilinx.com:interface:sc_rtl:1.0 M06_SC_AR
create_bd_intf_pin -mode Master -vlnv xilinx.com:interface:sc_rtl:1.0 M07_SC_AR
create_bd_intf_pin -mode Master -vlnv xilinx.com:interface:sc_rtl:1.0 M08_SC_AR
create_bd_intf_pin -mode Master -vlnv xilinx.com:interface:sc_rtl:1.0 M09_SC_AR
create_bd_intf_pin -mode Master -vlnv xilinx.com:interface:sc_rtl:1.0 M10_SC_AR
create_bd_intf_pin -mode Master -vlnv xilinx.com:interface:sc_rtl:1.0 M11_SC_AR
create_bd_intf_pin -mode Master -vlnv xilinx.com:interface:sc_rtl:1.0 M12_SC_AR
create_bd_intf_pin -mode Master -vlnv xilinx.com:interface:sc_rtl:1.0 M13_SC_AR
create_bd_intf_pin -mode Master -vlnv xilinx.com:interface:sc_rtl:1.0 M14_SC_AR
create_bd_intf_pin -mode Master -vlnv xilinx.com:interface:sc_rtl:1.0 M15_SC_AR
create_bd_intf_pin -mode Slave -vlnv xilinx.com:interface:sc_rtl:1.0 S00_SC_R
create_bd_intf_pin -mode Slave -vlnv xilinx.com:interface:sc_rtl:1.0 S01_SC_R
create_bd_intf_pin -mode Slave -vlnv xilinx.com:interface:sc_rtl:1.0 S02_SC_R
create_bd_intf_pin -mode Slave -vlnv xilinx.com:interface:sc_rtl:1.0 S03_SC_R
create_bd_intf_pin -mode Slave -vlnv xilinx.com:interface:sc_rtl:1.0 S04_SC_R
create_bd_intf_pin -mode Slave -vlnv xilinx.com:interface:sc_rtl:1.0 S05_SC_R
create_bd_intf_pin -mode Slave -vlnv xilinx.com:interface:sc_rtl:1.0 S06_SC_R
create_bd_intf_pin -mode Slave -vlnv xilinx.com:interface:sc_rtl:1.0 S07_SC_R
create_bd_intf_pin -mode Slave -vlnv xilinx.com:interface:sc_rtl:1.0 S08_SC_R
create_bd_intf_pin -mode Slave -vlnv xilinx.com:interface:sc_rtl:1.0 S09_SC_R
create_bd_intf_pin -mode Slave -vlnv xilinx.com:interface:sc_rtl:1.0 S10_SC_R
create_bd_intf_pin -mode Slave -vlnv xilinx.com:interface:sc_rtl:1.0 S11_SC_R
create_bd_intf_pin -mode Slave -vlnv xilinx.com:interface:sc_rtl:1.0 S12_SC_R
create_bd_intf_pin -mode Slave -vlnv xilinx.com:interface:sc_rtl:1.0 S13_SC_R
create_bd_intf_pin -mode Slave -vlnv xilinx.com:interface:sc_rtl:1.0 S14_SC_R
create_bd_intf_pin -mode Slave -vlnv xilinx.com:interface:sc_rtl:1.0 S15_SC_R
create_bd_intf_pin -mode Master -vlnv xilinx.com:interface:sc_rtl:1.0 M00_SC_R
create_bd_intf_pin -mode Slave -vlnv xilinx.com:interface:sc_rtl:1.0 S00_SC_AW
create_bd_intf_pin -mode Master -vlnv xilinx.com:interface:sc_rtl:1.0 M00_SC_AW
create_bd_intf_pin -mode Master -vlnv xilinx.com:interface:sc_rtl:1.0 M01_SC_AW
create_bd_intf_pin -mode Master -vlnv xilinx.com:interface:sc_rtl:1.0 M02_SC_AW
create_bd_intf_pin -mode Master -vlnv xilinx.com:interface:sc_rtl:1.0 M03_SC_AW
create_bd_intf_pin -mode Master -vlnv xilinx.com:interface:sc_rtl:1.0 M04_SC_AW
create_bd_intf_pin -mode Master -vlnv xilinx.com:interface:sc_rtl:1.0 M05_SC_AW
create_bd_intf_pin -mode Master -vlnv xilinx.com:interface:sc_rtl:1.0 M06_SC_AW
create_bd_intf_pin -mode Master -vlnv xilinx.com:interface:sc_rtl:1.0 M07_SC_AW
create_bd_intf_pin -mode Master -vlnv xilinx.com:interface:sc_rtl:1.0 M08_SC_AW
create_bd_intf_pin -mode Master -vlnv xilinx.com:interface:sc_rtl:1.0 M09_SC_AW
create_bd_intf_pin -mode Master -vlnv xilinx.com:interface:sc_rtl:1.0 M10_SC_AW
create_bd_intf_pin -mode Master -vlnv xilinx.com:interface:sc_rtl:1.0 M11_SC_AW
create_bd_intf_pin -mode Master -vlnv xilinx.com:interface:sc_rtl:1.0 M12_SC_AW
create_bd_intf_pin -mode Master -vlnv xilinx.com:interface:sc_rtl:1.0 M13_SC_AW
create_bd_intf_pin -mode Master -vlnv xilinx.com:interface:sc_rtl:1.0 M14_SC_AW
create_bd_intf_pin -mode Master -vlnv xilinx.com:interface:sc_rtl:1.0 M15_SC_AW
create_bd_intf_pin -mode Slave -vlnv xilinx.com:interface:sc_rtl:1.0 S00_SC_W
create_bd_intf_pin -mode Master -vlnv xilinx.com:interface:sc_rtl:1.0 M00_SC_W
create_bd_intf_pin -mode Master -vlnv xilinx.com:interface:sc_rtl:1.0 M01_SC_W
create_bd_intf_pin -mode Master -vlnv xilinx.com:interface:sc_rtl:1.0 M02_SC_W
create_bd_intf_pin -mode Master -vlnv xilinx.com:interface:sc_rtl:1.0 M03_SC_W
create_bd_intf_pin -mode Master -vlnv xilinx.com:interface:sc_rtl:1.0 M04_SC_W
create_bd_intf_pin -mode Master -vlnv xilinx.com:interface:sc_rtl:1.0 M05_SC_W
create_bd_intf_pin -mode Master -vlnv xilinx.com:interface:sc_rtl:1.0 M06_SC_W
create_bd_intf_pin -mode Master -vlnv xilinx.com:interface:sc_rtl:1.0 M07_SC_W
create_bd_intf_pin -mode Master -vlnv xilinx.com:interface:sc_rtl:1.0 M08_SC_W
create_bd_intf_pin -mode Master -vlnv xilinx.com:interface:sc_rtl:1.0 M09_SC_W
create_bd_intf_pin -mode Master -vlnv xilinx.com:interface:sc_rtl:1.0 M10_SC_W
create_bd_intf_pin -mode Master -vlnv xilinx.com:interface:sc_rtl:1.0 M11_SC_W
create_bd_intf_pin -mode Master -vlnv xilinx.com:interface:sc_rtl:1.0 M12_SC_W
create_bd_intf_pin -mode Master -vlnv xilinx.com:interface:sc_rtl:1.0 M13_SC_W
create_bd_intf_pin -mode Master -vlnv xilinx.com:interface:sc_rtl:1.0 M14_SC_W
create_bd_intf_pin -mode Master -vlnv xilinx.com:interface:sc_rtl:1.0 M15_SC_W
create_bd_intf_pin -mode Slave -vlnv xilinx.com:interface:sc_rtl:1.0 S00_SC_B
create_bd_intf_pin -mode Slave -vlnv xilinx.com:interface:sc_rtl:1.0 S01_SC_B
create_bd_intf_pin -mode Slave -vlnv xilinx.com:interface:sc_rtl:1.0 S02_SC_B
create_bd_intf_pin -mode Slave -vlnv xilinx.com:interface:sc_rtl:1.0 S03_SC_B
create_bd_intf_pin -mode Slave -vlnv xilinx.com:interface:sc_rtl:1.0 S04_SC_B
create_bd_intf_pin -mode Slave -vlnv xilinx.com:interface:sc_rtl:1.0 S05_SC_B
create_bd_intf_pin -mode Slave -vlnv xilinx.com:interface:sc_rtl:1.0 S06_SC_B
create_bd_intf_pin -mode Slave -vlnv xilinx.com:interface:sc_rtl:1.0 S07_SC_B
create_bd_intf_pin -mode Slave -vlnv xilinx.com:interface:sc_rtl:1.0 S08_SC_B
create_bd_intf_pin -mode Slave -vlnv xilinx.com:interface:sc_rtl:1.0 S09_SC_B
create_bd_intf_pin -mode Slave -vlnv xilinx.com:interface:sc_rtl:1.0 S10_SC_B
create_bd_intf_pin -mode Slave -vlnv xilinx.com:interface:sc_rtl:1.0 S11_SC_B
create_bd_intf_pin -mode Slave -vlnv xilinx.com:interface:sc_rtl:1.0 S12_SC_B
create_bd_intf_pin -mode Slave -vlnv xilinx.com:interface:sc_rtl:1.0 S13_SC_B
create_bd_intf_pin -mode Slave -vlnv xilinx.com:interface:sc_rtl:1.0 S14_SC_B
create_bd_intf_pin -mode Slave -vlnv xilinx.com:interface:sc_rtl:1.0 S15_SC_B
create_bd_intf_pin -mode Master -vlnv xilinx.com:interface:sc_rtl:1.0 M00_SC_B
create_bd_pin -dir I -type clk aclk
create_bd_pin -dir I -type rst aresetn

create_bd_cell -type ip -vlnv xilinx.com:ip:sc_switchboard:1.0 ar_switchboard
set_property -dict [list \
  CONFIG.M00_S00_CONNECTIVITY 1 \
  CONFIG.M01_S00_CONNECTIVITY 1 \
  CONFIG.M02_S00_CONNECTIVITY 1 \
  CONFIG.M03_S00_CONNECTIVITY 1 \
  CONFIG.M04_S00_CONNECTIVITY 1 \
  CONFIG.M05_S00_CONNECTIVITY 1 \
  CONFIG.M06_S00_CONNECTIVITY 1 \
  CONFIG.M07_S00_CONNECTIVITY 1 \
  CONFIG.M08_S00_CONNECTIVITY 1 \
  CONFIG.M09_S00_CONNECTIVITY 1 \
  CONFIG.M10_S00_CONNECTIVITY 1 \
  CONFIG.M11_S00_CONNECTIVITY 1 \
  CONFIG.M12_S00_CONNECTIVITY 1 \
  CONFIG.M13_S00_CONNECTIVITY 1 \
  CONFIG.M14_S00_CONNECTIVITY 1 \
  CONFIG.M15_S00_CONNECTIVITY 1 \
  CONFIG.M_PIPELINES 1 \
  CONFIG.NUM_MI 16 \
  CONFIG.NUM_SI 1 \
  CONFIG.PAYLD_WIDTH 296 \
  CONFIG.S_LATENCY 0 \
  CONFIG.S_PIPELINES 0 \
] [get_bd_cells ar_switchboard]
create_bd_cell -type ip -vlnv xilinx.com:ip:sc_switchboard:1.0 r_switchboard
set_property -dict [list \
  CONFIG.M00_S00_CONNECTIVITY 1 \
  CONFIG.M00_S01_CONNECTIVITY 1 \
  CONFIG.M00_S02_CONNECTIVITY 1 \
  CONFIG.M00_S03_CONNECTIVITY 1 \
  CONFIG.M00_S04_CONNECTIVITY 1 \
  CONFIG.M00_S05_CONNECTIVITY 1 \
  CONFIG.M00_S06_CONNECTIVITY 1 \
  CONFIG.M00_S07_CONNECTIVITY 1 \
  CONFIG.M00_S08_CONNECTIVITY 1 \
  CONFIG.M00_S09_CONNECTIVITY 1 \
  CONFIG.M00_S10_CONNECTIVITY 1 \
  CONFIG.M00_S11_CONNECTIVITY 1 \
  CONFIG.M00_S12_CONNECTIVITY 1 \
  CONFIG.M00_S13_CONNECTIVITY 1 \
  CONFIG.M00_S14_CONNECTIVITY 1 \
  CONFIG.M00_S15_CONNECTIVITY 1 \
  CONFIG.M_PIPELINES 1 \
  CONFIG.NUM_MI 1 \
  CONFIG.NUM_SI 16 \
  CONFIG.PAYLD_WIDTH 54 \
  CONFIG.S_LATENCY 0 \
  CONFIG.S_PIPELINES 0 \
] [get_bd_cells r_switchboard]
create_bd_cell -type ip -vlnv xilinx.com:ip:sc_switchboard:1.0 aw_switchboard
set_property -dict [list \
  CONFIG.M00_S00_CONNECTIVITY 1 \
  CONFIG.M01_S00_CONNECTIVITY 1 \
  CONFIG.M02_S00_CONNECTIVITY 1 \
  CONFIG.M03_S00_CONNECTIVITY 1 \
  CONFIG.M04_S00_CONNECTIVITY 1 \
  CONFIG.M05_S00_CONNECTIVITY 1 \
  CONFIG.M06_S00_CONNECTIVITY 1 \
  CONFIG.M07_S00_CONNECTIVITY 1 \
  CONFIG.M08_S00_CONNECTIVITY 1 \
  CONFIG.M09_S00_CONNECTIVITY 1 \
  CONFIG.M10_S00_CONNECTIVITY 1 \
  CONFIG.M11_S00_CONNECTIVITY 1 \
  CONFIG.M12_S00_CONNECTIVITY 1 \
  CONFIG.M13_S00_CONNECTIVITY 1 \
  CONFIG.M14_S00_CONNECTIVITY 1 \
  CONFIG.M15_S00_CONNECTIVITY 1 \
  CONFIG.M_PIPELINES 1 \
  CONFIG.NUM_MI 16 \
  CONFIG.NUM_SI 1 \
  CONFIG.PAYLD_WIDTH 296 \
  CONFIG.S_LATENCY 0 \
  CONFIG.S_PIPELINES 0 \
] [get_bd_cells aw_switchboard]
create_bd_cell -type ip -vlnv xilinx.com:ip:sc_switchboard:1.0 w_switchboard
set_property -dict [list \
  CONFIG.M00_S00_CONNECTIVITY 1 \
  CONFIG.M01_S00_CONNECTIVITY 1 \
  CONFIG.M02_S00_CONNECTIVITY 1 \
  CONFIG.M03_S00_CONNECTIVITY 1 \
  CONFIG.M04_S00_CONNECTIVITY 1 \
  CONFIG.M05_S00_CONNECTIVITY 1 \
  CONFIG.M06_S00_CONNECTIVITY 1 \
  CONFIG.M07_S00_CONNECTIVITY 1 \
  CONFIG.M08_S00_CONNECTIVITY 1 \
  CONFIG.M09_S00_CONNECTIVITY 1 \
  CONFIG.M10_S00_CONNECTIVITY 1 \
  CONFIG.M11_S00_CONNECTIVITY 1 \
  CONFIG.M12_S00_CONNECTIVITY 1 \
  CONFIG.M13_S00_CONNECTIVITY 1 \
  CONFIG.M14_S00_CONNECTIVITY 1 \
  CONFIG.M15_S00_CONNECTIVITY 1 \
  CONFIG.M_PIPELINES 1 \
  CONFIG.NUM_MI 16 \
  CONFIG.NUM_SI 1 \
  CONFIG.PAYLD_WIDTH 67 \
  CONFIG.S_LATENCY 0 \
  CONFIG.S_PIPELINES 0 \
] [get_bd_cells w_switchboard]
create_bd_cell -type ip -vlnv xilinx.com:ip:sc_switchboard:1.0 b_switchboard
set_property -dict [list \
  CONFIG.M00_S00_CONNECTIVITY 1 \
  CONFIG.M00_S01_CONNECTIVITY 1 \
  CONFIG.M00_S02_CONNECTIVITY 1 \
  CONFIG.M00_S03_CONNECTIVITY 1 \
  CONFIG.M00_S04_CONNECTIVITY 1 \
  CONFIG.M00_S05_CONNECTIVITY 1 \
  CONFIG.M00_S06_CONNECTIVITY 1 \
  CONFIG.M00_S07_CONNECTIVITY 1 \
  CONFIG.M00_S08_CONNECTIVITY 1 \
  CONFIG.M00_S09_CONNECTIVITY 1 \
  CONFIG.M00_S10_CONNECTIVITY 1 \
  CONFIG.M00_S11_CONNECTIVITY 1 \
  CONFIG.M00_S12_CONNECTIVITY 1 \
  CONFIG.M00_S13_CONNECTIVITY 1 \
  CONFIG.M00_S14_CONNECTIVITY 1 \
  CONFIG.M00_S15_CONNECTIVITY 1 \
  CONFIG.M_PIPELINES 1 \
  CONFIG.NUM_MI 1 \
  CONFIG.NUM_SI 16 \
  CONFIG.PAYLD_WIDTH 121 \
  CONFIG.S_LATENCY 0 \
  CONFIG.S_PIPELINES 0 \
] [get_bd_cells b_switchboard]

# ---- hierarchy /s00_entry_pipeline ----
current_bd_instance /s00_entry_pipeline
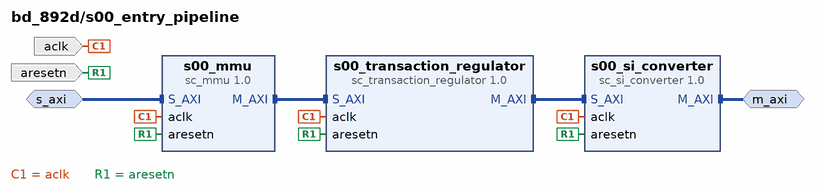
[diagram p5: block diagram inside /s00_entry_pipeline]
create_bd_intf_pin -mode Slave -vlnv xilinx.com:interface:aximm_rtl:1.0 s_axi
create_bd_intf_pin -mode Master -vlnv xilinx.com:interface:aximm_rtl:1.0 m_axi
create_bd_pin -dir I -type clk aclk
create_bd_pin -dir I -type rst aresetn

create_bd_cell -type ip -vlnv xilinx.com:ip:sc_mmu:1.0 s00_mmu
set_property -dict [list \
  CONFIG.ADDR_WIDTH 40 \
  CONFIG.ID_WIDTH 4 \
  CONFIG.IS_CASCADED 1 \
  CONFIG.MSC000_ROUTE 0b0000000000000001 \
  CONFIG.MSC001_ROUTE 0b0000000000000010 \
  CONFIG.MSC002_ROUTE 0b0000000000000100 \
  CONFIG.MSC003_ROUTE 0b0000000000001000 \
  CONFIG.MSC004_ROUTE 0b0000000000010000 \
  CONFIG.MSC005_ROUTE 0b0000000000100000 \
  CONFIG.MSC006_ROUTE 0b0000000001000000 \
  CONFIG.MSC007_ROUTE 0b0000000010000000 \
  CONFIG.MSC008_ROUTE 0b0000000100000000 \
  CONFIG.MSC009_ROUTE 0b0000001000000000 \
  CONFIG.MSC010_ROUTE 0b0000010000000000 \
  CONFIG.MSC011_ROUTE 0b0000100000000000 \
  CONFIG.MSC012_ROUTE 0b0001000000000000 \
  CONFIG.MSC013_ROUTE 0b0010000000000000 \
  CONFIG.MSC014_ROUTE 0b0100000000000000 \
  CONFIG.MSC015_ROUTE 0b1000000000000000 \
  CONFIG.MSC_ROUTE_WIDTH 16 \
  CONFIG.NUM_MSC 16 \
  CONFIG.NUM_READ_OUTSTANDING 8 \
  CONFIG.NUM_WRITE_OUTSTANDING 8 \
  CONFIG.RDATA_WIDTH 32 \
  CONFIG.READ_WRITE_MODE READ_WRITE \
  CONFIG.S_ARUSER_WIDTH 130 \
  CONFIG.S_AWUSER_WIDTH 130 \
  CONFIG.S_BUSER_WIDTH 114 \
  CONFIG.S_PROTOCOL AXI4 \
  CONFIG.S_RUSER_WIDTH 14 \
  CONFIG.S_WUSER_WIDTH 14 \
  CONFIG.WDATA_WIDTH 32 \
] [get_bd_cells s00_mmu]
create_bd_cell -type ip -vlnv xilinx.com:ip:sc_transaction_regulator:1.0 s00_transaction_regulator
set_property -dict [list \
  CONFIG.ADDR_WIDTH 40 \
  CONFIG.IS_CASCADED 1 \
  CONFIG.MEP_IDENTIFIER_WIDTH 2 \
  CONFIG.NUM_READ_OUTSTANDING 8 \
  CONFIG.NUM_WRITE_OUTSTANDING 8 \
  CONFIG.RDATA_WIDTH 32 \
  CONFIG.READ_WRITE_MODE READ_WRITE \
  CONFIG.S_ID_WIDTH 4 \
  CONFIG.WDATA_WIDTH 32 \
] [get_bd_cells s00_transaction_regulator]
create_bd_cell -type ip -vlnv xilinx.com:ip:sc_si_converter:1.0 s00_si_converter
set_property -dict [list \
  CONFIG.ADDR_WIDTH 40 \
  CONFIG.ID_WIDTH 4 \
  CONFIG.IS_CASCADED 1 \
  CONFIG.MEP_IDENTIFIER_WIDTH 2 \
  CONFIG.MSC000_RDATA_WIDTH 32 \
  CONFIG.MSC000_WDATA_WIDTH 32 \
  CONFIG.MSC001_RDATA_WIDTH 32 \
  CONFIG.MSC001_WDATA_WIDTH 32 \
  CONFIG.MSC002_RDATA_WIDTH 32 \
  CONFIG.MSC002_WDATA_WIDTH 32 \
  CONFIG.MSC003_RDATA_WIDTH 32 \
  CONFIG.MSC003_WDATA_WIDTH 32 \
  CONFIG.MSC004_RDATA_WIDTH 32 \
  CONFIG.MSC004_WDATA_WIDTH 32 \
  CONFIG.MSC005_RDATA_WIDTH 32 \
  CONFIG.MSC005_WDATA_WIDTH 32 \
  CONFIG.MSC006_RDATA_WIDTH 32 \
  CONFIG.MSC006_WDATA_WIDTH 32 \
  CONFIG.MSC007_RDATA_WIDTH 32 \
  CONFIG.MSC007_WDATA_WIDTH 32 \
  CONFIG.MSC008_RDATA_WIDTH 32 \
  CONFIG.MSC008_WDATA_WIDTH 32 \
  CONFIG.MSC009_RDATA_WIDTH 32 \
  CONFIG.MSC009_WDATA_WIDTH 32 \
  CONFIG.MSC010_RDATA_WIDTH 32 \
  CONFIG.MSC010_WDATA_WIDTH 32 \
  CONFIG.MSC011_RDATA_WIDTH 32 \
  CONFIG.MSC011_WDATA_WIDTH 32 \
  CONFIG.MSC012_RDATA_WIDTH 32 \
  CONFIG.MSC012_WDATA_WIDTH 32 \
  CONFIG.MSC013_RDATA_WIDTH 32 \
  CONFIG.MSC013_WDATA_WIDTH 32 \
  CONFIG.MSC014_RDATA_WIDTH 32 \
  CONFIG.MSC014_WDATA_WIDTH 32 \
  CONFIG.MSC015_RDATA_WIDTH 32 \
  CONFIG.MSC015_WDATA_WIDTH 32 \
  CONFIG.NUM_MSC 16 \
  CONFIG.NUM_READ_OUTSTANDING 8 \
  CONFIG.NUM_SEG 16 \
  CONFIG.NUM_WRITE_OUTSTANDING 8 \
  CONFIG.RDATA_WIDTH 32 \
  CONFIG.READ_WRITE_MODE READ_WRITE \
  CONFIG.SEP000_PROTOCOL AXI4LITE \
  CONFIG.SEP000_RDATA_WIDTH 32 \
  CONFIG.SEP000_WDATA_WIDTH 32 \
  CONFIG.SEP001_PROTOCOL AXI4LITE \
  CONFIG.SEP001_RDATA_WIDTH 32 \
  CONFIG.SEP001_WDATA_WIDTH 32 \
  CONFIG.SEP002_PROTOCOL AXI4LITE \
  CONFIG.SEP002_RDATA_WIDTH 32 \
  CONFIG.SEP002_WDATA_WIDTH 32 \
  CONFIG.SEP003_PROTOCOL AXI4LITE \
  CONFIG.SEP003_RDATA_WIDTH 32 \
  CONFIG.SEP003_WDATA_WIDTH 32 \
  CONFIG.SEP004_PROTOCOL AXI4LITE \
  CONFIG.SEP004_RDATA_WIDTH 32 \
  CONFIG.SEP004_WDATA_WIDTH 32 \
  CONFIG.SEP005_PROTOCOL AXI4LITE \
  CONFIG.SEP005_RDATA_WIDTH 32 \
  CONFIG.SEP005_WDATA_WIDTH 32 \
  CONFIG.SEP006_PROTOCOL AXI4LITE \
  CONFIG.SEP006_RDATA_WIDTH 32 \
  CONFIG.SEP006_WDATA_WIDTH 32 \
  CONFIG.SEP007_PROTOCOL AXI4LITE \
  CONFIG.SEP007_RDATA_WIDTH 32 \
  CONFIG.SEP007_WDATA_WIDTH 32 \
  CONFIG.SEP008_PROTOCOL AXI4LITE \
  CONFIG.SEP008_RDATA_WIDTH 32 \
  CONFIG.SEP008_WDATA_WIDTH 32 \
  CONFIG.SEP009_PROTOCOL AXI4LITE \
  CONFIG.SEP009_RDATA_WIDTH 32 \
  CONFIG.SEP009_WDATA_WIDTH 32 \
  CONFIG.SEP010_PROTOCOL AXI4LITE \
  CONFIG.SEP010_RDATA_WIDTH 32 \
  CONFIG.SEP010_WDATA_WIDTH 32 \
  CONFIG.SEP011_PROTOCOL AXI4LITE \
  CONFIG.SEP011_RDATA_WIDTH 32 \
  CONFIG.SEP011_WDATA_WIDTH 32 \
  CONFIG.SEP012_PROTOCOL AXI4 \
  CONFIG.SEP012_RDATA_WIDTH 32 \
  CONFIG.SEP012_WDATA_WIDTH 32 \
  CONFIG.SEP013_PROTOCOL AXI4 \
  CONFIG.SEP013_RDATA_WIDTH 32 \
  CONFIG.SEP013_WDATA_WIDTH 32 \
  CONFIG.SEP014_PROTOCOL AXI4 \
  CONFIG.SEP014_RDATA_WIDTH 32 \
  CONFIG.SEP014_WDATA_WIDTH 32 \
  CONFIG.SEP015_PROTOCOL AXI4 \
  CONFIG.SEP015_RDATA_WIDTH 32 \
  CONFIG.SEP015_WDATA_WIDTH 32 \
  CONFIG.WDATA_WIDTH 32 \
] [get_bd_cells s00_si_converter]

# ---- hierarchy /s00_nodes ----
current_bd_instance /s00_nodes
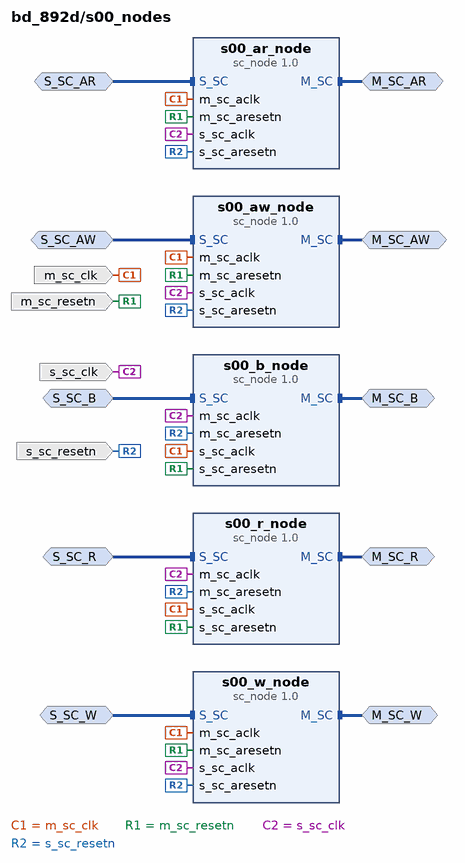
[diagram p6: block diagram inside /s00_nodes]
create_bd_intf_pin -mode Master -vlnv xilinx.com:interface:sc_rtl:1.0 M_SC_AR
create_bd_intf_pin -mode Slave -vlnv xilinx.com:interface:sc_rtl:1.0 S_SC_AR
create_bd_intf_pin -mode Master -vlnv xilinx.com:interface:sc_rtl:1.0 M_SC_R
create_bd_intf_pin -mode Slave -vlnv xilinx.com:interface:sc_rtl:1.0 S_SC_R
create_bd_intf_pin -mode Master -vlnv xilinx.com:interface:sc_rtl:1.0 M_SC_AW
create_bd_intf_pin -mode Slave -vlnv xilinx.com:interface:sc_rtl:1.0 S_SC_AW
create_bd_intf_pin -mode Master -vlnv xilinx.com:interface:sc_rtl:1.0 M_SC_W
create_bd_intf_pin -mode Slave -vlnv xilinx.com:interface:sc_rtl:1.0 S_SC_W
create_bd_intf_pin -mode Master -vlnv xilinx.com:interface:sc_rtl:1.0 M_SC_B
create_bd_intf_pin -mode Slave -vlnv xilinx.com:interface:sc_rtl:1.0 S_SC_B
create_bd_pin -dir I -type clk s_sc_clk
create_bd_pin -dir I -type rst s_sc_resetn
create_bd_pin -dir I -type clk m_sc_clk
create_bd_pin -dir I -type rst m_sc_resetn

create_bd_cell -type ip -vlnv xilinx.com:ip:sc_node:1.0 s00_ar_node
set_property -dict [list \
  CONFIG.ACLKEN_CONVERSION 0 \
  CONFIG.ACLK_RELATIONSHIP 1 \
  CONFIG.ADDR_WIDTH 40 \
  CONFIG.CHANNEL 2 \
  CONFIG.ID_WIDTH 4 \
  CONFIG.M00_NUM_BYTES 4 \
  CONFIG.M01_NUM_BYTES 4 \
  CONFIG.M02_NUM_BYTES 4 \
  CONFIG.M03_NUM_BYTES 4 \
  CONFIG.M04_NUM_BYTES 4 \
  CONFIG.M05_NUM_BYTES 4 \
  CONFIG.M06_NUM_BYTES 4 \
  CONFIG.M07_NUM_BYTES 4 \
  CONFIG.M08_NUM_BYTES 4 \
  CONFIG.M09_NUM_BYTES 4 \
  CONFIG.M10_NUM_BYTES 4 \
  CONFIG.M11_NUM_BYTES 4 \
  CONFIG.M12_NUM_BYTES 4 \
  CONFIG.M13_NUM_BYTES 4 \
  CONFIG.M14_NUM_BYTES 4 \
  CONFIG.M15_NUM_BYTES 4 \
  CONFIG.MAX_PAYLD_BYTES 4 \
  CONFIG.M_PIPELINE 0 \
  CONFIG.NUM_MI 16 \
  CONFIG.NUM_OUTSTANDING 8 \
  CONFIG.NUM_SI 1 \
  CONFIG.PAYLD_WIDTH 296 \
  CONFIG.S00_NUM_BYTES 4 \
  CONFIG.S01_NUM_BYTES 4 \
  CONFIG.S02_NUM_BYTES 4 \
  CONFIG.S03_NUM_BYTES 4 \
  CONFIG.S04_NUM_BYTES 4 \
  CONFIG.S05_NUM_BYTES 4 \
  CONFIG.S06_NUM_BYTES 4 \
  CONFIG.S07_NUM_BYTES 4 \
  CONFIG.S08_NUM_BYTES 4 \
  CONFIG.S09_NUM_BYTES 4 \
  CONFIG.S10_NUM_BYTES 4 \
  CONFIG.S11_NUM_BYTES 4 \
  CONFIG.S12_NUM_BYTES 4 \
  CONFIG.S13_NUM_BYTES 4 \
  CONFIG.S14_NUM_BYTES 4 \
  CONFIG.S15_NUM_BYTES 4 \
  CONFIG.SC_ROUTE_WIDTH 16 \
  CONFIG.USER_WIDTH 130 \
] [get_bd_cells s00_ar_node]
create_bd_cell -type ip -vlnv xilinx.com:ip:sc_node:1.0 s00_r_node
set_property -dict [list \
  CONFIG.ACLKEN_CONVERSION 0 \
  CONFIG.ACLK_RELATIONSHIP 1 \
  CONFIG.ADDR_WIDTH 40 \
  CONFIG.CHANNEL 0 \
  CONFIG.ID_WIDTH 4 \
  CONFIG.M00_NUM_BYTES 4 \
  CONFIG.M01_NUM_BYTES 4 \
  CONFIG.M02_NUM_BYTES 4 \
  CONFIG.M03_NUM_BYTES 4 \
  CONFIG.M04_NUM_BYTES 4 \
  CONFIG.M05_NUM_BYTES 4 \
  CONFIG.M06_NUM_BYTES 4 \
  CONFIG.M07_NUM_BYTES 4 \
  CONFIG.M08_NUM_BYTES 4 \
  CONFIG.M09_NUM_BYTES 4 \
  CONFIG.M10_NUM_BYTES 4 \
  CONFIG.M11_NUM_BYTES 4 \
  CONFIG.M12_NUM_BYTES 4 \
  CONFIG.M13_NUM_BYTES 4 \
  CONFIG.M14_NUM_BYTES 4 \
  CONFIG.M15_NUM_BYTES 4 \
  CONFIG.MAX_PAYLD_BYTES 4 \
  CONFIG.M_SEND_PIPELINE 0 \
  CONFIG.NUM_MI 1 \
  CONFIG.NUM_OUTSTANDING 8 \
  CONFIG.NUM_SI 16 \
  CONFIG.PAYLD_WIDTH 54 \
  CONFIG.S00_NUM_BYTES 4 \
  CONFIG.S01_NUM_BYTES 4 \
  CONFIG.S02_NUM_BYTES 4 \
  CONFIG.S03_NUM_BYTES 4 \
  CONFIG.S04_NUM_BYTES 4 \
  CONFIG.S05_NUM_BYTES 4 \
  CONFIG.S06_NUM_BYTES 4 \
  CONFIG.S07_NUM_BYTES 4 \
  CONFIG.S08_NUM_BYTES 4 \
  CONFIG.S09_NUM_BYTES 4 \
  CONFIG.S10_NUM_BYTES 4 \
  CONFIG.S11_NUM_BYTES 4 \
  CONFIG.S12_NUM_BYTES 4 \
  CONFIG.S13_NUM_BYTES 4 \
  CONFIG.S14_NUM_BYTES 4 \
  CONFIG.S15_NUM_BYTES 4 \
  CONFIG.SC_ROUTE_WIDTH 1 \
  CONFIG.S_LATENCY 1 \
  CONFIG.USER_BITS_PER_BYTE 0 \
] [get_bd_cells s00_r_node]
create_bd_cell -type ip -vlnv xilinx.com:ip:sc_node:1.0 s00_aw_node
set_property -dict [list \
  CONFIG.ACLKEN_CONVERSION 0 \
  CONFIG.ACLK_RELATIONSHIP 1 \
  CONFIG.ADDR_WIDTH 40 \
  CONFIG.CHANNEL 3 \
  CONFIG.ID_WIDTH 4 \
  CONFIG.M00_NUM_BYTES 4 \
  CONFIG.M01_NUM_BYTES 4 \
  CONFIG.M02_NUM_BYTES 4 \
  CONFIG.M03_NUM_BYTES 4 \
  CONFIG.M04_NUM_BYTES 4 \
  CONFIG.M05_NUM_BYTES 4 \
  CONFIG.M06_NUM_BYTES 4 \
  CONFIG.M07_NUM_BYTES 4 \
  CONFIG.M08_NUM_BYTES 4 \
  CONFIG.M09_NUM_BYTES 4 \
  CONFIG.M10_NUM_BYTES 4 \
  CONFIG.M11_NUM_BYTES 4 \
  CONFIG.M12_NUM_BYTES 4 \
  CONFIG.M13_NUM_BYTES 4 \
  CONFIG.M14_NUM_BYTES 4 \
  CONFIG.M15_NUM_BYTES 4 \
  CONFIG.MAX_PAYLD_BYTES 4 \
  CONFIG.M_PIPELINE 0 \
  CONFIG.NUM_MI 16 \
  CONFIG.NUM_OUTSTANDING 8 \
  CONFIG.NUM_SI 1 \
  CONFIG.PAYLD_WIDTH 296 \
  CONFIG.S00_NUM_BYTES 4 \
  CONFIG.S01_NUM_BYTES 4 \
  CONFIG.S02_NUM_BYTES 4 \
  CONFIG.S03_NUM_BYTES 4 \
  CONFIG.S04_NUM_BYTES 4 \
  CONFIG.S05_NUM_BYTES 4 \
  CONFIG.S06_NUM_BYTES 4 \
  CONFIG.S07_NUM_BYTES 4 \
  CONFIG.S08_NUM_BYTES 4 \
  CONFIG.S09_NUM_BYTES 4 \
  CONFIG.S10_NUM_BYTES 4 \
  CONFIG.S11_NUM_BYTES 4 \
  CONFIG.S12_NUM_BYTES 4 \
  CONFIG.S13_NUM_BYTES 4 \
  CONFIG.S14_NUM_BYTES 4 \
  CONFIG.S15_NUM_BYTES 4 \
  CONFIG.SC_ROUTE_WIDTH 16 \
  CONFIG.USER_WIDTH 130 \
] [get_bd_cells s00_aw_node]
create_bd_cell -type ip -vlnv xilinx.com:ip:sc_node:1.0 s00_w_node
set_property -dict [list \
  CONFIG.ACLKEN_CONVERSION 0 \
  CONFIG.ACLK_RELATIONSHIP 1 \
  CONFIG.ADDR_WIDTH 40 \
  CONFIG.CHANNEL 1 \
  CONFIG.ID_WIDTH 4 \
  CONFIG.M00_NUM_BYTES 4 \
  CONFIG.M01_NUM_BYTES 4 \
  CONFIG.M02_NUM_BYTES 4 \
  CONFIG.M03_NUM_BYTES 4 \
  CONFIG.M04_NUM_BYTES 4 \
  CONFIG.M05_NUM_BYTES 4 \
  CONFIG.M06_NUM_BYTES 4 \
  CONFIG.M07_NUM_BYTES 4 \
  CONFIG.M08_NUM_BYTES 4 \
  CONFIG.M09_NUM_BYTES 4 \
  CONFIG.M10_NUM_BYTES 4 \
  CONFIG.M11_NUM_BYTES 4 \
  CONFIG.M12_NUM_BYTES 4 \
  CONFIG.M13_NUM_BYTES 4 \
  CONFIG.M14_NUM_BYTES 4 \
  CONFIG.M15_NUM_BYTES 4 \
  CONFIG.MAX_PAYLD_BYTES 4 \
  CONFIG.M_PIPELINE 0 \
  CONFIG.NUM_MI 16 \
  CONFIG.NUM_OUTSTANDING 8 \
  CONFIG.NUM_SI 1 \
  CONFIG.PAYLD_WIDTH 67 \
  CONFIG.S00_NUM_BYTES 4 \
  CONFIG.S01_NUM_BYTES 4 \
  CONFIG.S02_NUM_BYTES 4 \
  CONFIG.S03_NUM_BYTES 4 \
  CONFIG.S04_NUM_BYTES 4 \
  CONFIG.S05_NUM_BYTES 4 \
  CONFIG.S06_NUM_BYTES 4 \
  CONFIG.S07_NUM_BYTES 4 \
  CONFIG.S08_NUM_BYTES 4 \
  CONFIG.S09_NUM_BYTES 4 \
  CONFIG.S10_NUM_BYTES 4 \
  CONFIG.S11_NUM_BYTES 4 \
  CONFIG.S12_NUM_BYTES 4 \
  CONFIG.S13_NUM_BYTES 4 \
  CONFIG.S14_NUM_BYTES 4 \
  CONFIG.S15_NUM_BYTES 4 \
  CONFIG.SC_ROUTE_WIDTH 16 \
  CONFIG.USER_BITS_PER_BYTE 0 \
] [get_bd_cells s00_w_node]
create_bd_cell -type ip -vlnv xilinx.com:ip:sc_node:1.0 s00_b_node
set_property -dict [list \
  CONFIG.ACLKEN_CONVERSION 0 \
  CONFIG.ACLK_RELATIONSHIP 1 \
  CONFIG.ADDR_WIDTH 40 \
  CONFIG.CHANNEL 4 \
  CONFIG.ID_WIDTH 4 \
  CONFIG.M00_NUM_BYTES 4 \
  CONFIG.M01_NUM_BYTES 4 \
  CONFIG.M02_NUM_BYTES 4 \
  CONFIG.M03_NUM_BYTES 4 \
  CONFIG.M04_NUM_BYTES 4 \
  CONFIG.M05_NUM_BYTES 4 \
  CONFIG.M06_NUM_BYTES 4 \
  CONFIG.M07_NUM_BYTES 4 \
  CONFIG.M08_NUM_BYTES 4 \
  CONFIG.M09_NUM_BYTES 4 \
  CONFIG.M10_NUM_BYTES 4 \
  CONFIG.M11_NUM_BYTES 4 \
  CONFIG.M12_NUM_BYTES 4 \
  CONFIG.M13_NUM_BYTES 4 \
  CONFIG.M14_NUM_BYTES 4 \
  CONFIG.M15_NUM_BYTES 4 \
  CONFIG.MAX_PAYLD_BYTES 4 \
  CONFIG.M_SEND_PIPELINE 0 \
  CONFIG.NUM_MI 1 \
  CONFIG.NUM_OUTSTANDING 8 \
  CONFIG.NUM_SI 16 \
  CONFIG.PAYLD_WIDTH 121 \
  CONFIG.S00_NUM_BYTES 4 \
  CONFIG.S01_NUM_BYTES 4 \
  CONFIG.S02_NUM_BYTES 4 \
  CONFIG.S03_NUM_BYTES 4 \
  CONFIG.S04_NUM_BYTES 4 \
  CONFIG.S05_NUM_BYTES 4 \
  CONFIG.S06_NUM_BYTES 4 \
  CONFIG.S07_NUM_BYTES 4 \
  CONFIG.S08_NUM_BYTES 4 \
  CONFIG.S09_NUM_BYTES 4 \
  CONFIG.S10_NUM_BYTES 4 \
  CONFIG.S11_NUM_BYTES 4 \
  CONFIG.S12_NUM_BYTES 4 \
  CONFIG.S13_NUM_BYTES 4 \
  CONFIG.S14_NUM_BYTES 4 \
  CONFIG.S15_NUM_BYTES 4 \
  CONFIG.SC_ROUTE_WIDTH 1 \
  CONFIG.S_LATENCY 1 \
  CONFIG.USER_WIDTH 114 \
] [get_bd_cells s00_b_node]
